# EAGLE design CarTracker (EAGLE 5.11)

## Sheet 1 of 7
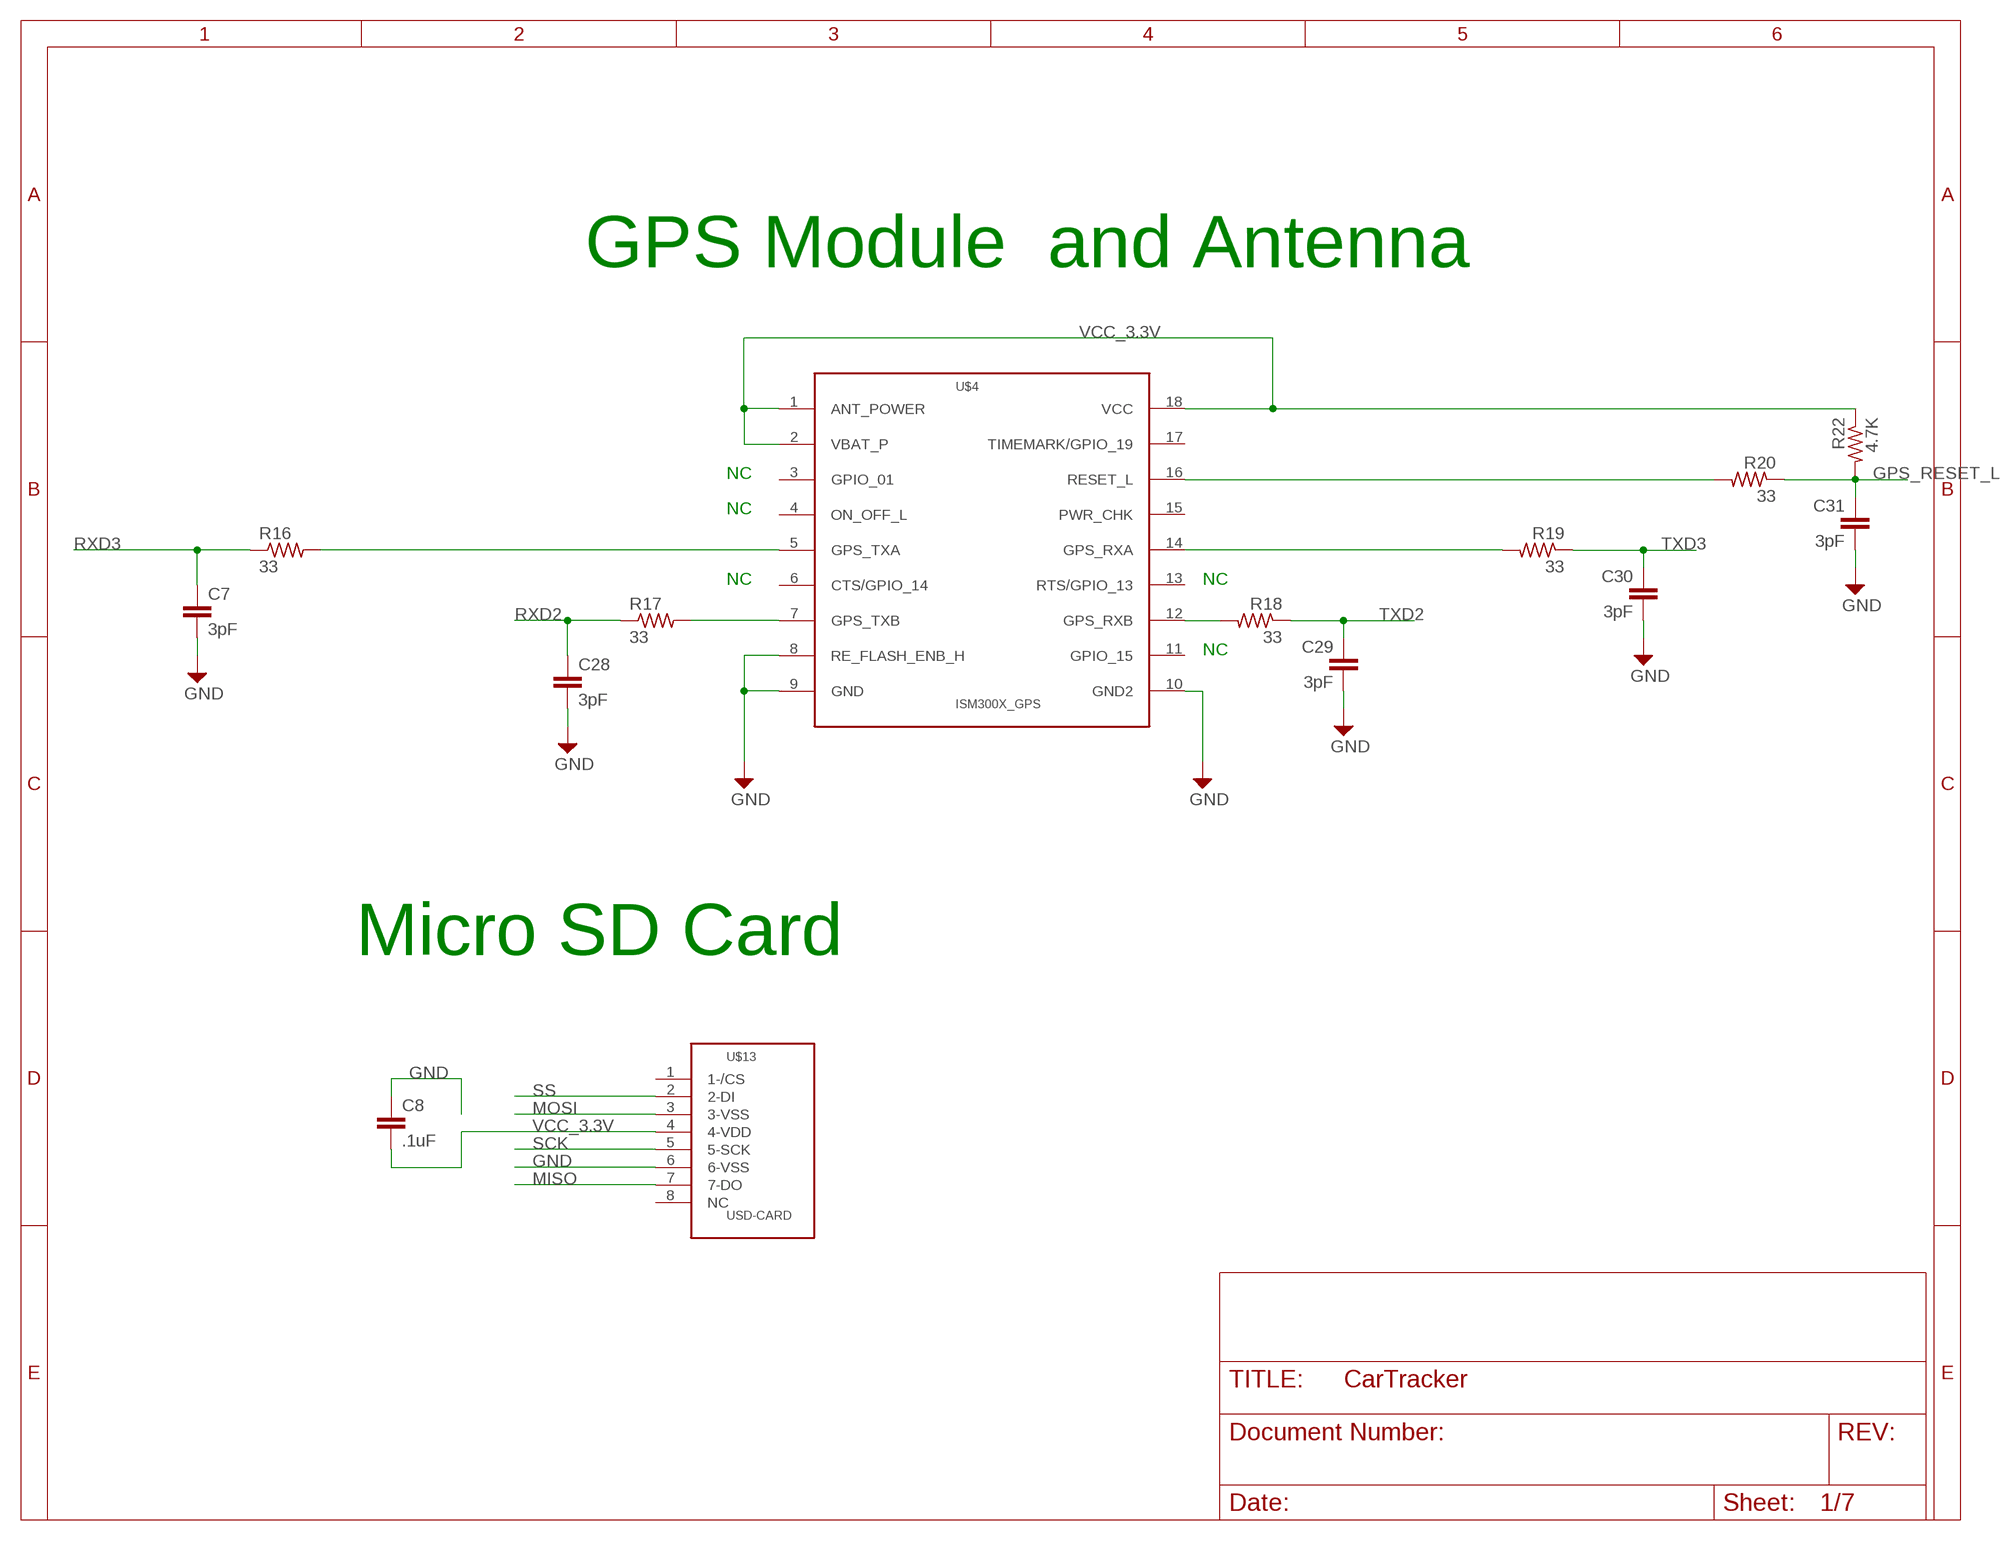
[diagram p0: schematic, sheet 1]

### Parts
C7  3pF  C-EUC0402  [C0402]
C8  .1uF  C-EUC0603  [C0603]
C28  3pF  C-EUC0402  [C0402]
C29  3pF  C-EUC0402  [C0402]
C30  3pF  C-EUC0402  [C0402]
C31  3pF  C-EUC0402  [C0402]
R16  33  R-US_R0402  [R0402]
R17  33  R-US_R0402  [R0402]
R18  33  R-US_R0603  [R0603]
R19  33  R-US_R0603  [R0603]
R20  33  R-US_R0603  [R0603]
R22  4.7K  R-US_R0603  [R0603]
U$4  ISM300X_GPS  [INVENTEKSYS_GPS]
U$13  USD-CARD  [502774-0891]

### Nets
GND [supply]: C7.2 C8.1 C28.2 C29.2 C30.2 C31.2 U$4.8(RE_FLASH_ENB_H) U$4.9(GND) U$4.10(GND2) U$13.6(6-VSS) ; also sheet 2,3,4,5,6,7
GPS_RESET_L: C31.1 R20.1 R22.2
MISO: U$13.7(7-DO) ; also sheet 5
MOSI: U$13.3(3-VSS) ; also sheet 5
N$5: R16.2 U$4.5(GPS_TXA)
N$6: R17.2 U$4.7(GPS_TXB)
N$8: R18.2 U$4.12(GPS_RXB)
N$9: R19.2 U$4.14(GPS_RXA)
N$10: R20.2 U$4.16(RESET_L)
RXD2: C28.1 R17.1 ; also sheet 5
RXD3: C7.1 R16.1 ; also sheet 5
SCK: U$13.5(5-SCK) ; also sheet 5
SS: U$13.2(2-DI) ; also sheet 5
TXD2: C29.1 R18.1 ; also sheet 5
TXD3: C30.1 R19.1 ; also sheet 5
VCC_3.3V: C8.2 R22.1 U$4.1(ANT_POWER) U$4.2(VBAT_P) U$4.18(VCC) U$13.4(4-VDD) ; also sheet 2,3,4,5,7
Unconnected: U$4.3(GPIO_01) U$4.4(ON_OFF_L) U$4.6(CTS/GPIO_14) U$4.11(GPIO_15) U$4.13(RTS/GPIO_13) U$4.15(PWR_CHK) U$4.17(TIMEMARK/GPIO_19) U$13.1(1-/CS) U$13.8(NC)

### Notes on the sheet
- GPS Module  and Antenna
- NC
- NC
- NC | NC
- NC
- Micro SD Card

## Sheet 2 of 7
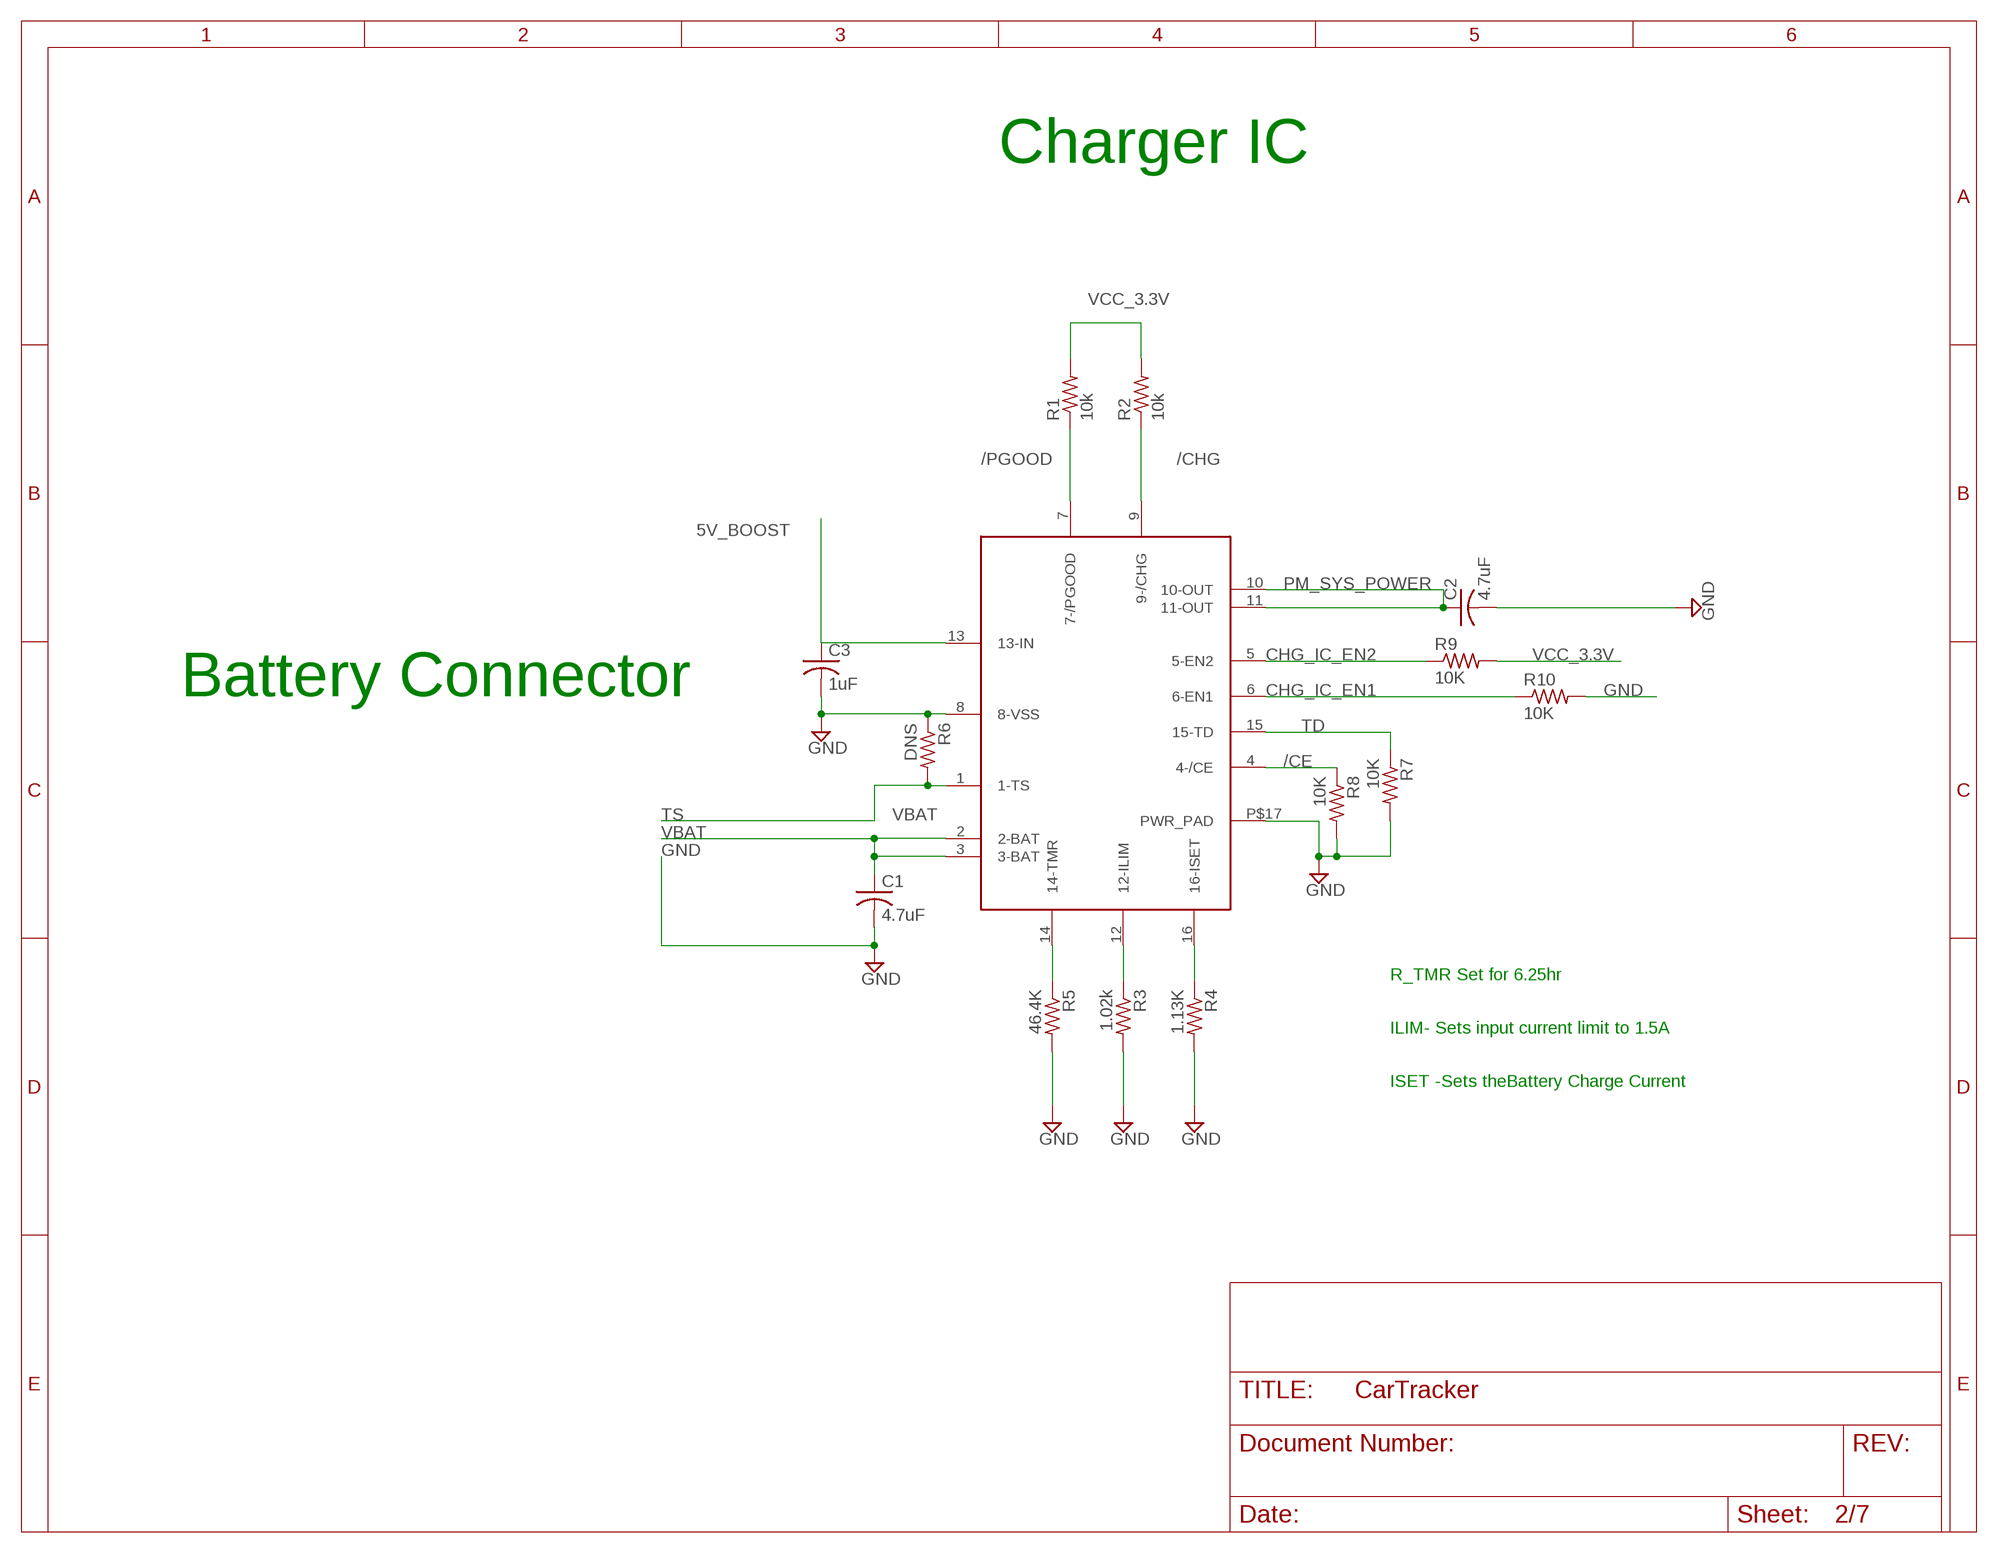
[diagram p1: schematic, sheet 2]

### Parts
C1  4.7uF  C-USC0805  [C0805]
C2  4.7uF  C-USC0805  [C0805]
C3  1uF  C-USC0805  [C0805]
R1  10k  R-US_R0603  [R0603]
R2  10k  R-US_R0603  [R0603]
R3  1.02k  R-US_R0603  [R0603]
R4  1.13K  R-US_R0603  [R0603]
R5  46.4K  R-US_R0603  [R0603]
R6  DNS  R-US_R0603  [R0603]
R7  10K  R-US_R0603  [R0603]
R8  10K  R-US_R0603  [R0603]
R9  10K  R-US_R0603  [R0603]
R10  10K  R-US_R0603  [R0603]
U$1  BQ24072  [S-PVQFN-N16]

### Nets
5V_BOOST: C3.1 U$1.13(13-IN) ; also sheet 3
/CE: R8.1 U$1.4(4-/CE)
/CHG: R2.1 U$1.9(9-/CHG) ; also sheet 5
/PGOOD: R1.1 U$1.7(7-/PGOOD) ; also sheet 5
CHG_IC_EN1: R10.1 U$1.6(6-EN1)
CHG_IC_EN2: R9.1 U$1.5(5-EN2)
GND [supply]: C1.2 C2.2 C3.2 R3.2 R4.2 R5.2 R6.1 R7.2 R8.2 R10.2 U$1.8(8-VSS) U$1.P$17(PWR_PAD) ; also sheet 1,3,4,5,6,7
N$1: R5.1 U$1.14(14-TMR)
N$2: R3.1 U$1.12(12-ILIM)
N$3: R4.1 U$1.16(16-ISET)
PM_SYS_POWER: C2.1 U$1.10(10-OUT) U$1.11(11-OUT) ; also sheet 3,4
TD: R7.1 U$1.15(15-TD)
TS: R6.2 U$1.1(1-TS)
VBAT: C1.1 U$1.2(2-BAT) U$1.3(3-BAT) ; also sheet 3
VCC_3.3V: R1.2 R2.2 R9.2 ; also sheet 1,3,4,5,7

### Notes on the sheet
- Charger IC
- Battery Connector
- R_TMR Set for 6.25hr
- ILIM- Sets input current limit to 1.5A
- ISET -Sets theBattery Charge Current

## Sheet 3 of 7
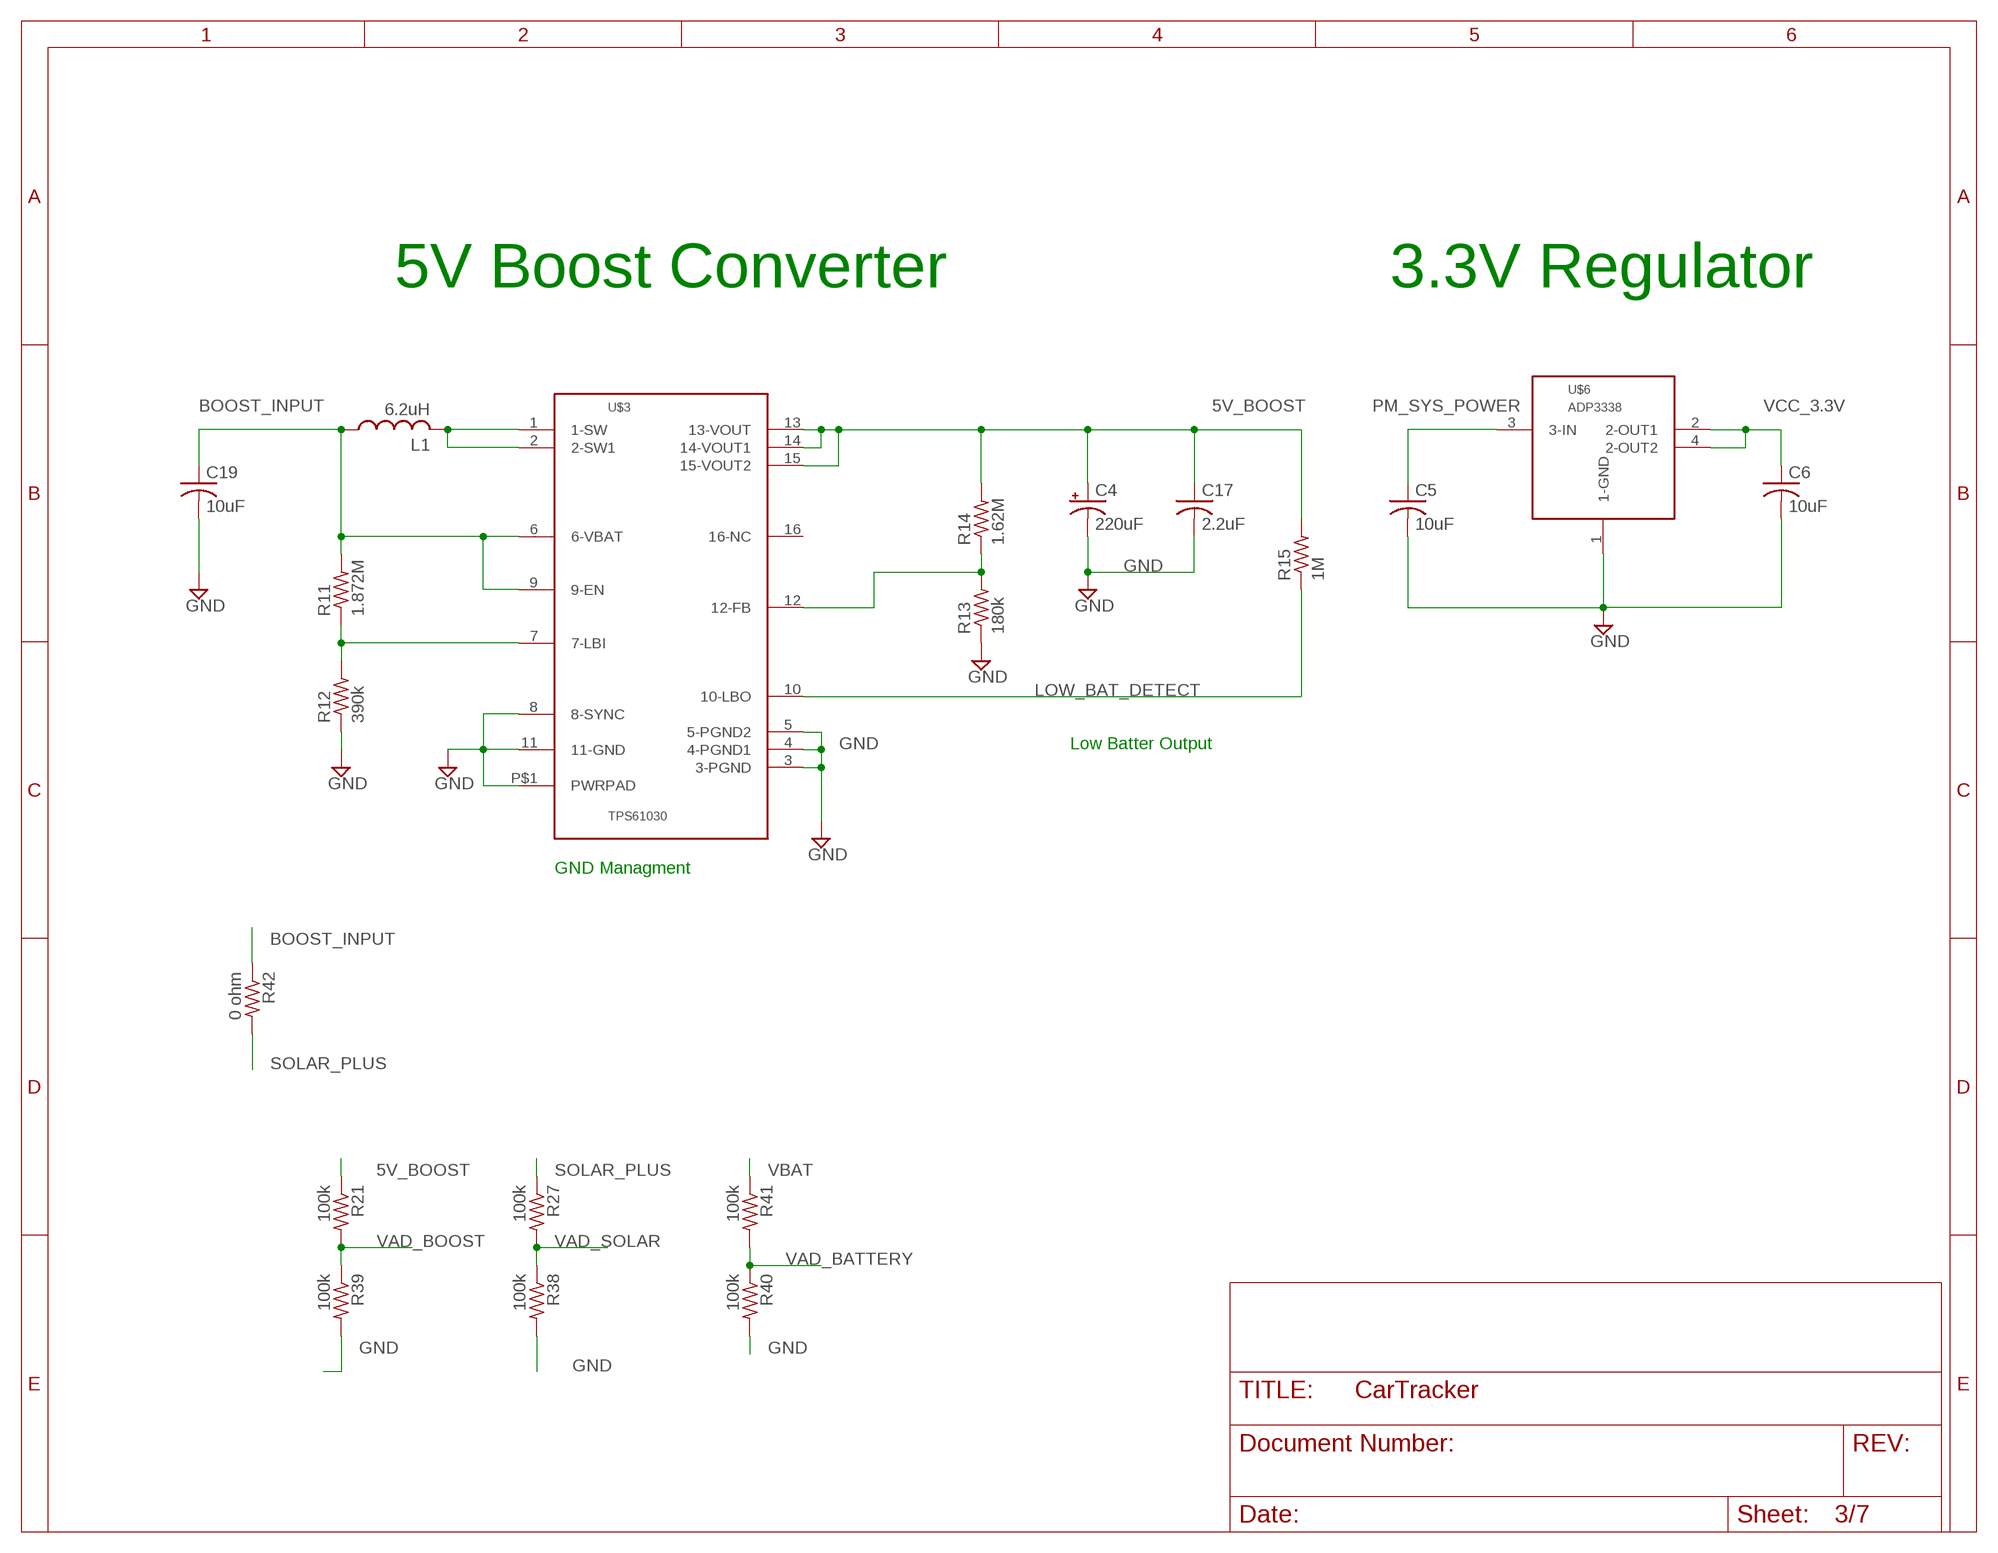
[diagram p2: schematic, sheet 3]

### Parts
C4  220uF  CPOL-USD/7343-31W  [D/7343-31W]
C5  10uF  C-USC1206  [C1206]
C6  10uF  C-USC1206  [C1206]
C17  2.2uF  C-USC0805  [C0805]
C19  10uF  C-USC1206  [C1206]
L1  6.2uH  L_US  [INDUCTOR_7447798620]
R11  1.872M  R-US_R0603  [R0603]
R12  390k  R-US_R0603  [R0603]
R13  180k  R-US_R0603  [R0603]
R14  1.62M  R-US_R0603  [R0603]
R15  1M  R-US_R0603  [R0603]
R21  100k  R-US_R0603  [R0603]
R27  100k  R-US_R0603  [R0603]
R38  100k  R-US_R0603  [R0603]
R39  100k  R-US_R0603  [R0603]
R40  100k  R-US_R0603  [R0603]
R41  100k  R-US_R0603  [R0603]
R42  0 ohm  R-US_R0603  [R0603]
U$3  TPS61030  [TSSOP16_TI]
U$6  ADP3338  [SOT223]

### Nets
5V_BOOST: C4.+ C17.1 R14.2 R15.2 R21.1 U$3.13(13-VOUT) U$3.14(14-VOUT1) U$3.15(15-VOUT2) ; also sheet 2
BOOST_INPUT: C19.1 L1.P$1 R11.2 R42.1 U$3.6(6-VBAT) U$3.9(9-EN)
GND [supply]: C4.- C5.2 C6.2 C17.2 C19.2 R12.1 R13.1 R38.2 R39.2 R40.2 U$3.3(3-PGND) U$3.4(4-PGND1) U$3.5(5-PGND2) U$3.8(8-SYNC) U$3.11(11-GND) U$3.P$1(PWRPAD) U$6.1(1-GND) ; also sheet 1,2,4,5,6,7
LOW_BAT_DETECT: R15.1 U$3.10(10-LBO) ; also sheet 5
N$14: L1.P$2 U$3.1(1-SW) U$3.2(2-SW1)
N$20: R11.1 R12.2 U$3.7(7-LBI)
N$24: R13.2 R14.1 U$3.12(12-FB)
PM_SYS_POWER: C5.1 U$6.3(3-IN) ; also sheet 2,4
SOLAR_PLUS: R27.1 R42.2 ; also sheet 6
VAD_BATTERY: R40.1 R41.2 ; also sheet 5
VAD_BOOST: R21.2 R39.1 ; also sheet 5
VAD_SOLAR: R27.2 R38.1 ; also sheet 5
VBAT: R41.1 ; also sheet 2
VCC_3.3V: C6.1 U$6.2(2-OUT1) U$6.4(2-OUT2) ; also sheet 1,2,4,5,7
Unconnected: U$3.16(16-NC)

### Notes on the sheet
- 5V Boost Converter | 3.3V Regulator
- Low Batter Output
- GND Managment

## Sheet 4 of 7
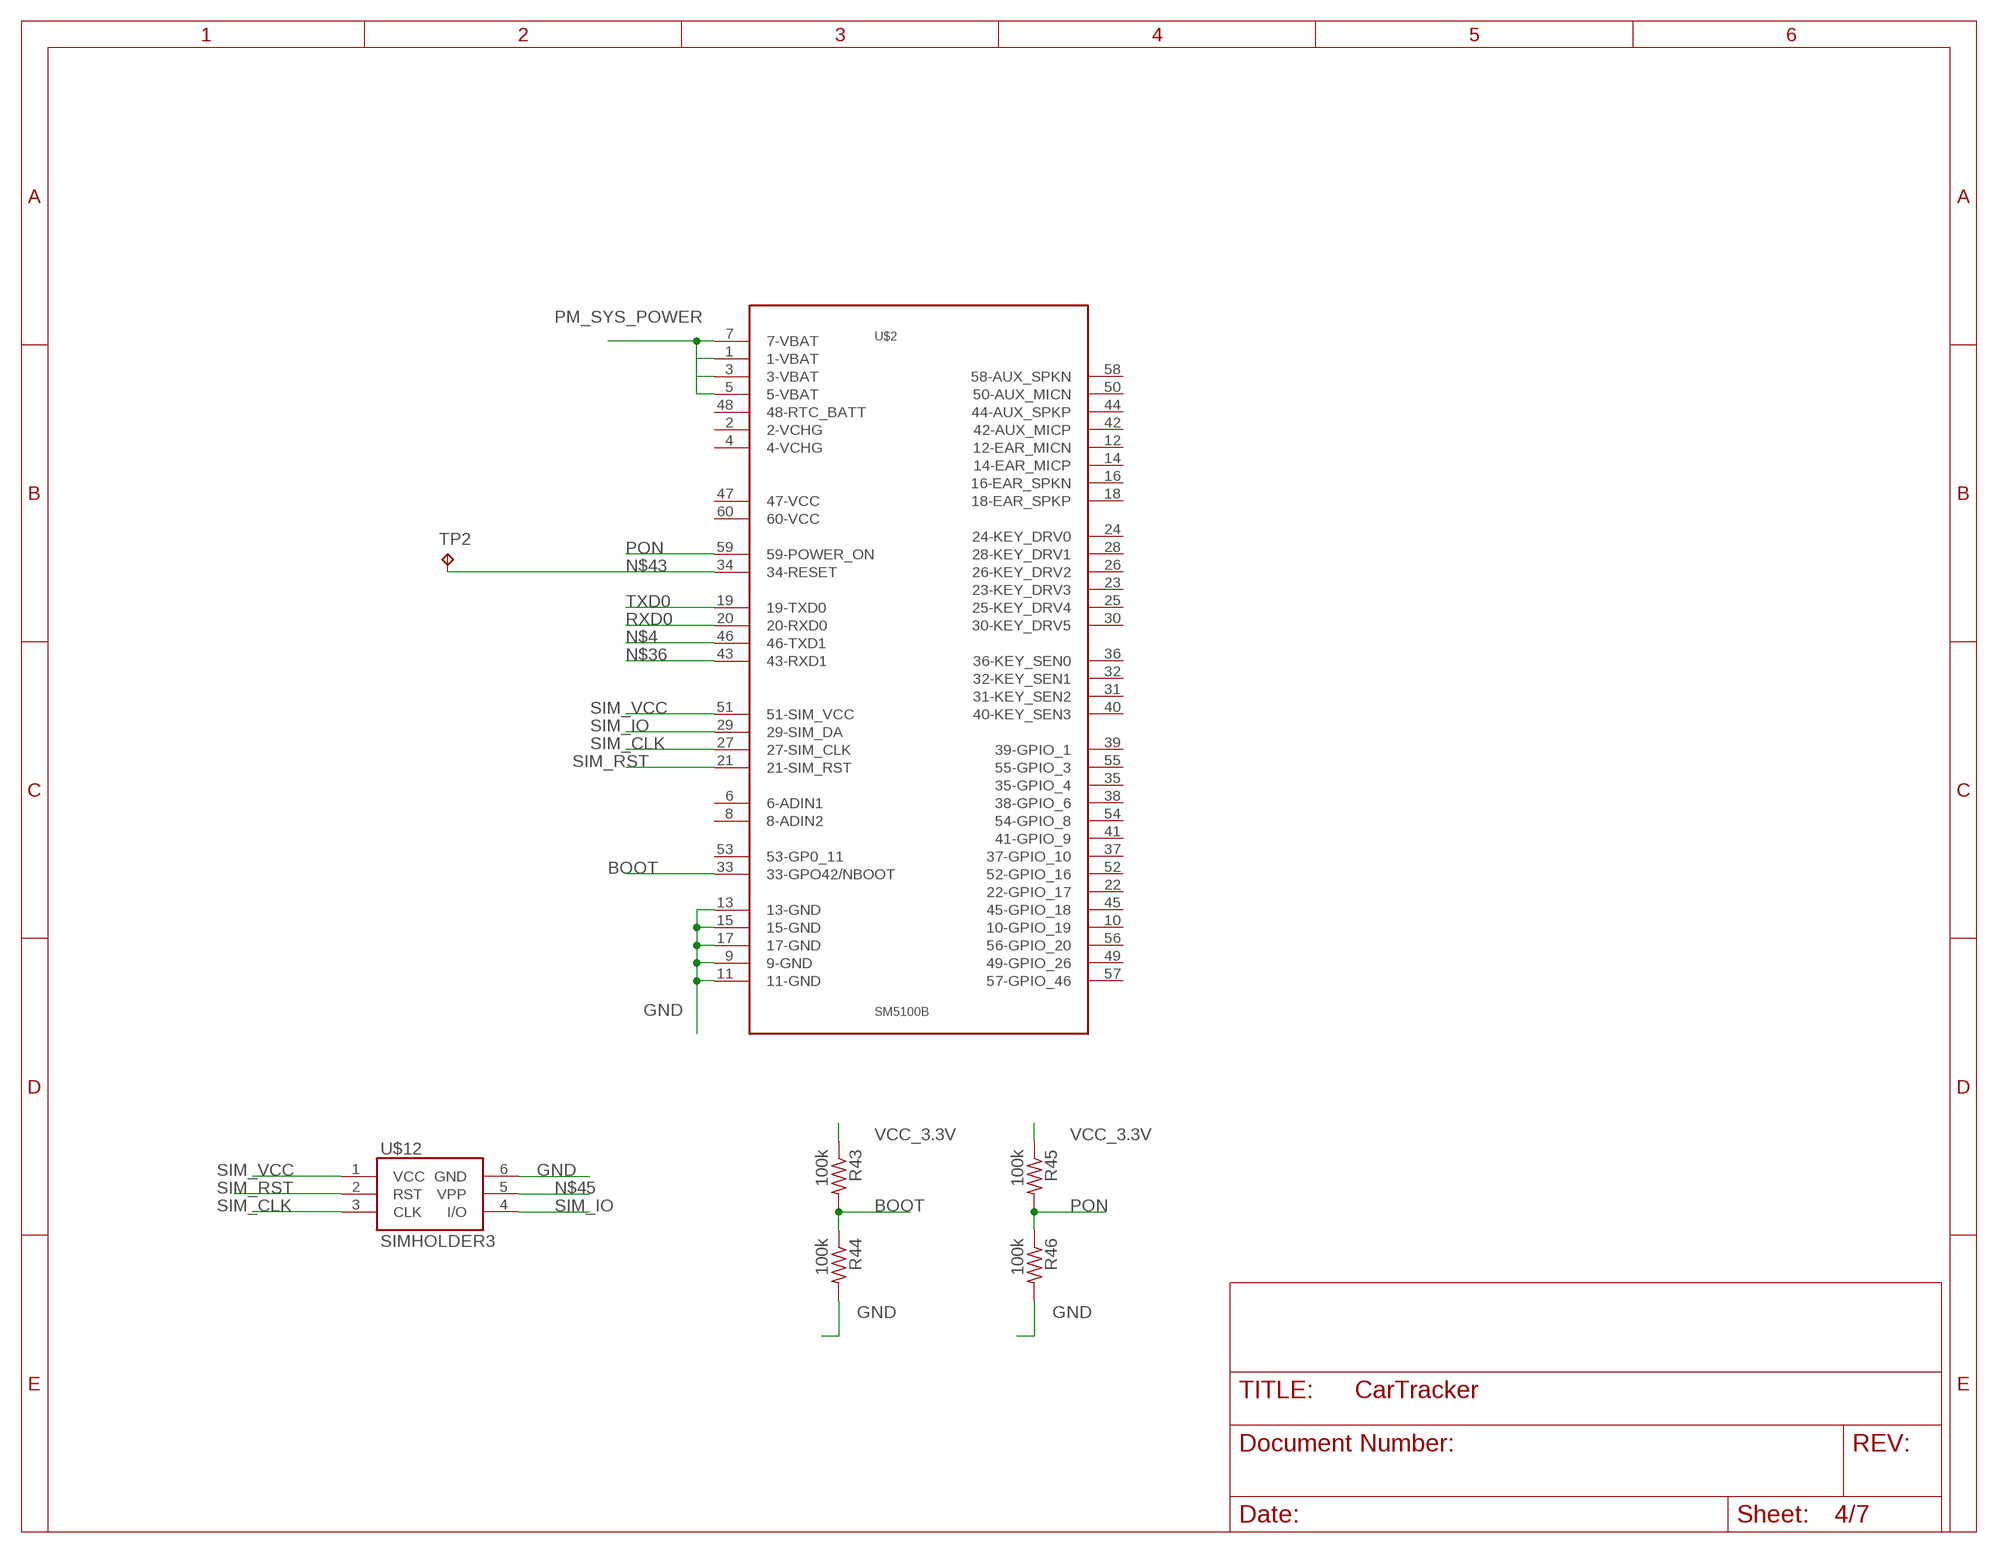
[diagram p3: schematic, sheet 4]

### Parts
R43  100k  R-US_R0603  [R0603]
R44  100k  R-US_R0603  [R0603]
R45  100k  R-US_R0603  [R0603]
R46  100k  R-US_R0603  [R0603]
TP2  TPTP15R  [TP15R]
U$2  SM5100B  [SM5100B]
U$12  SIMHOLDER3  [SIMHOLDER3]

### Nets
BOOT: R43.2 R44.1 U$2.33(33-GPO42/NBOOT)
GND [supply]: R44.2 R46.2 U$2.9(9-GND) U$2.11(11-GND) U$2.13(13-GND) U$2.15(15-GND) U$2.17(17-GND) U$12.6(GND) ; also sheet 1,2,3,5,6,7
N$4: U$2.46(46-TXD1)
N$36: U$2.43(43-RXD1)
N$43: TP2.TP U$2.34(34-RESET)
N$45: U$12.5(VPP)
PM_SYS_POWER: U$2.1(1-VBAT) U$2.3(3-VBAT) U$2.5(5-VBAT) U$2.7(7-VBAT) ; also sheet 2,3
PON: R45.2 R46.1 U$2.59(59-POWER_ON)
RXD0: U$2.20(20-RXD0) ; also sheet 5
SIM_CLK: U$2.27(27-SIM_CLK) U$12.3(CLK)
SIM_IO: U$2.29(29-SIM_DA) U$12.4(I/O)
SIM_RST: U$2.21(21-SIM_RST) U$12.2(RST)
SIM_VCC: U$2.51(51-SIM_VCC) U$12.1(VCC)
TXD0: U$2.19(19-TXD0) ; also sheet 5
VCC_3.3V: R43.1 R45.1 ; also sheet 1,2,3,5,7
Unconnected: U$2.2(2-VCHG) U$2.4(4-VCHG) U$2.6(6-ADIN1) U$2.8(8-ADIN2) U$2.10(10-GPIO_19) U$2.12(12-EAR_MICN) U$2.14(14-EAR_MICP) U$2.16(16-EAR_SPKN) U$2.18(18-EAR_SPKP) U$2.22(22-GPIO_17) U$2.23(23-KEY_DRV3) U$2.24(24-KEY_DRV0) U$2.25(25-KEY_DRV4) U$2.26(26-KEY_DRV2) U$2.28(28-KEY_DRV1) U$2.30(30-KEY_DRV5) U$2.31(31-KEY_SEN2) U$2.32(32-KEY_SEN1) U$2.35(35-GPIO_4) U$2.36(36-KEY_SEN0) U$2.37(37-GPIO_10) U$2.38(38-GPIO_6) U$2.39(39-GPIO_1) U$2.40(40-KEY_SEN3) U$2.41(41-GPIO_9) U$2.42(42-AUX_MICP) U$2.44(44-AUX_SPKP) U$2.45(45-GPIO_18) U$2.47(47-VCC) U$2.48(48-RTC_BATT) U$2.49(49-GPIO_26) U$2.50(50-AUX_MICN) U$2.52(52-GPIO_16) U$2.53(53-GP0_11) U$2.54(54-GPIO_8) U$2.55(55-GPIO_3) U$2.56(56-GPIO_20) U$2.57(57-GPIO_46) U$2.58(58-AUX_SPKN) U$2.60(60-VCC)

## Sheet 5 of 7
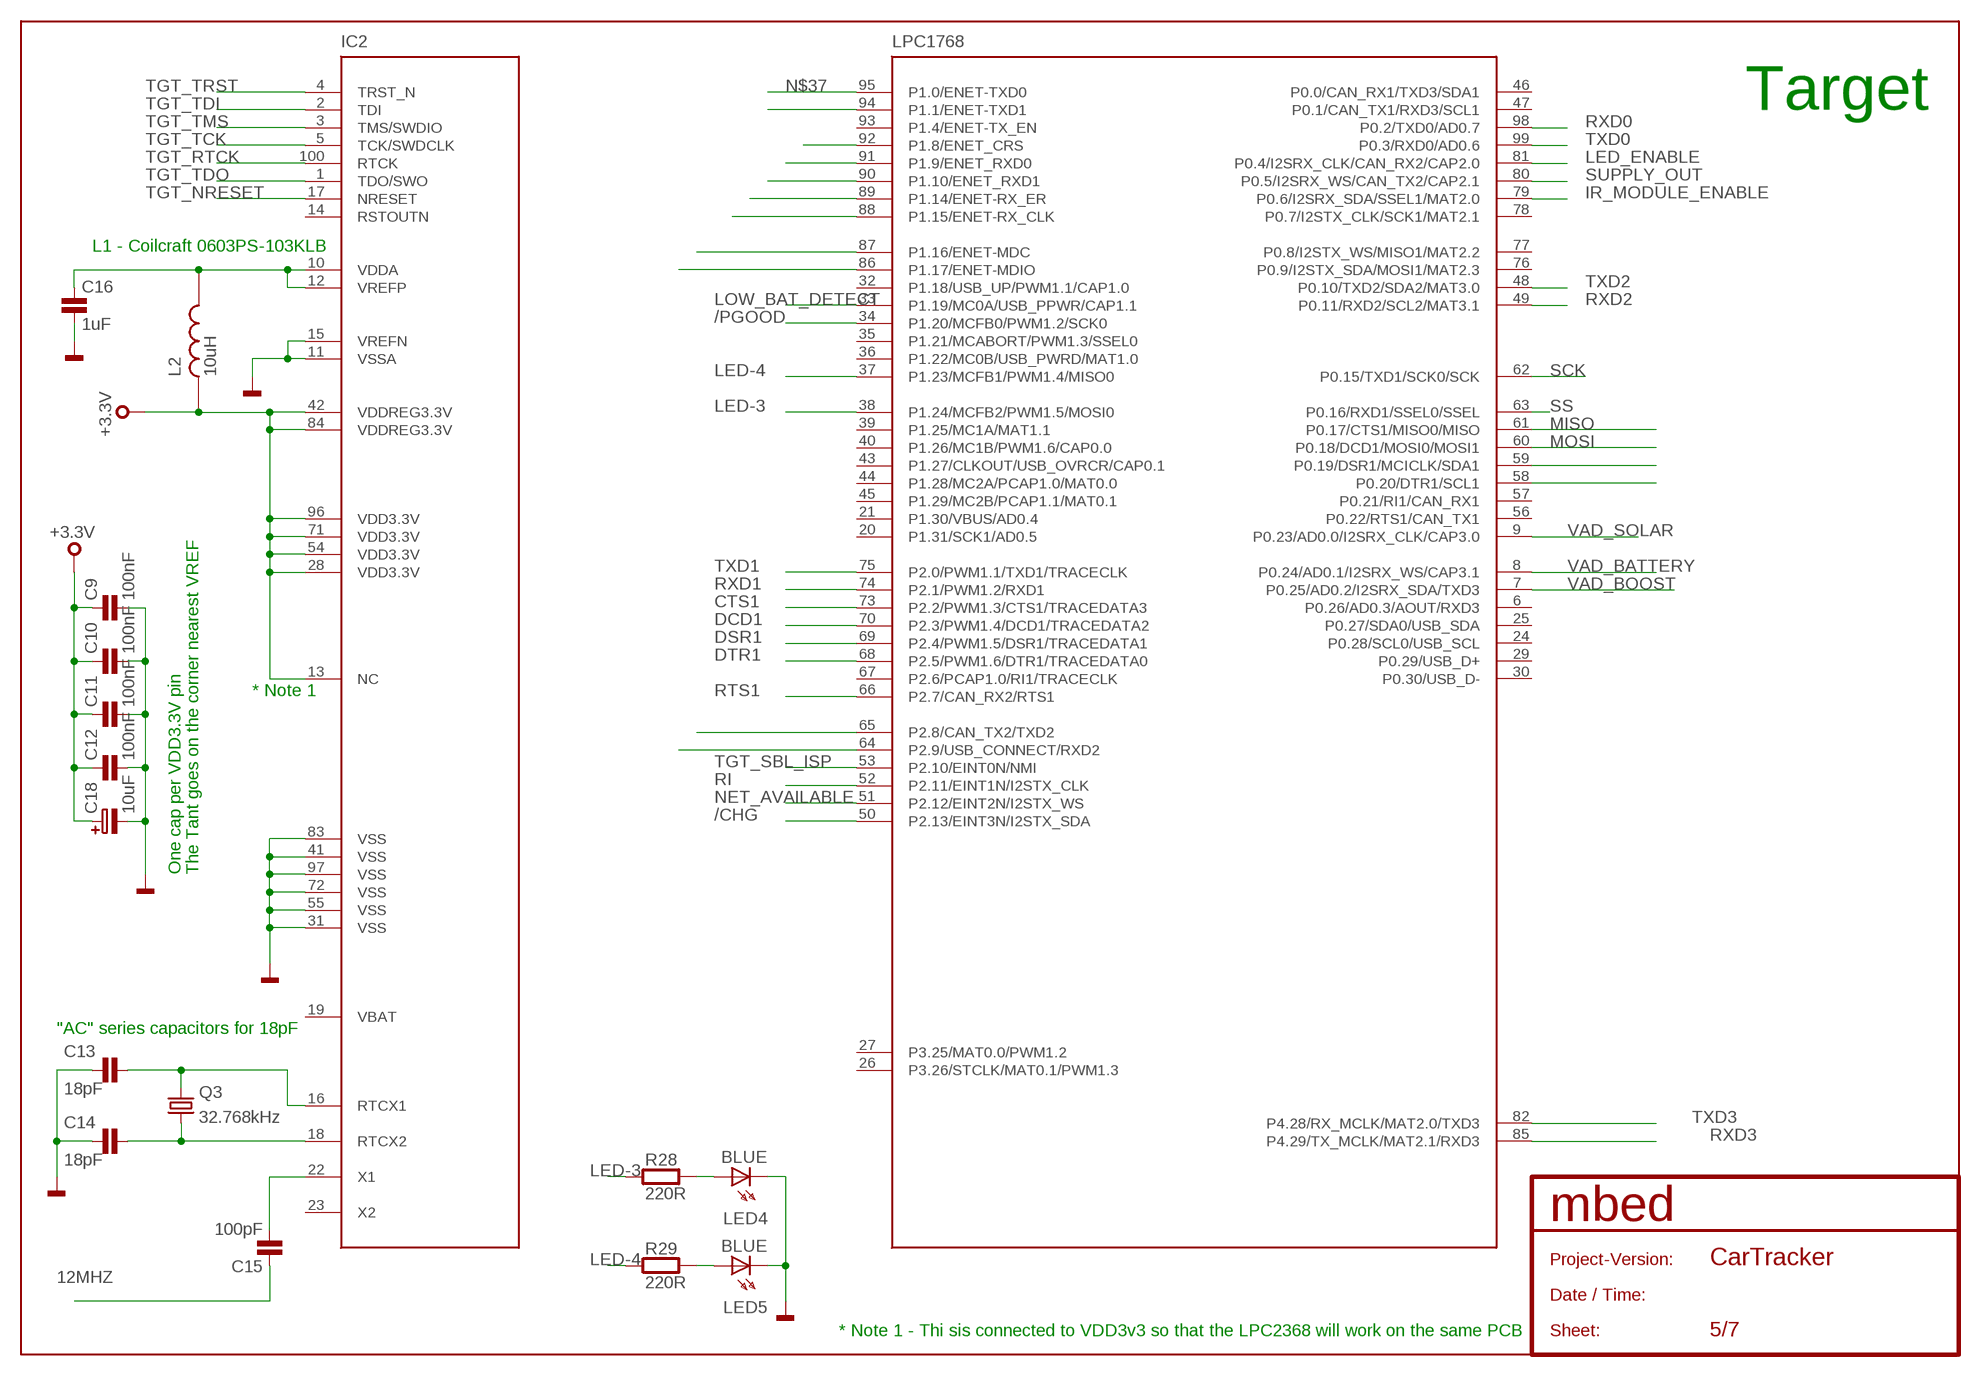
[diagram p4: schematic, sheet 5]

### Parts
C9  100nF  C0603  [0603]
C10  100nF  C0603  [0603]
C11  100nF  C0603  [0603]
C12  100nF  C0603  [0603]
C13  18pF  C0603  [0603]
C14  18pF  C0603  [0603]
C15  100pF  C0603  [0603]
C16  1uF  C0805  [0805]
C18  10uF  C-POLARISEDSMT_TANTALUM  [C106B]
IC2  LPC1768  [LQFP100]
L2  10uH  L_L  [L0603]
LED4  BLUE  LED_0805  [LED_0805]
LED5  BLUE  LED_0805  [LED_0805]
Q3  32.768kHz  CRYSTALFC135  [FC135]
R28  220R  R0603  [0603]
R29  220R  R0603  [0603]

### Nets
12MHZ: C15.1 ; also sheet 7
/CHG: IC2.50(P2.13/EINT3N/I2STX_SDA) ; also sheet 2
/PGOOD: IC2.34(P1.20/MCFB0/PWM1.2/SCK0) ; also sheet 2
CTS1: IC2.73(P2.2/PWM1.3/CTS1/TRACEDATA3)
DCD1: IC2.70(P2.3/PWM1.4/DCD1/TRACEDATA2)
DSR1: IC2.69(P2.4/PWM1.5/DSR1/TRACEDATA1)
DTR1: IC2.68(P2.5/PWM1.6/DTR1/TRACEDATA0)
GND [supply]: C9.2 C10.2 C11.2 C12.2 C13.1 C14.1 C16.2 C18.2 IC2.11(VSSA) IC2.15(VREFN) IC2.31(VSS) IC2.41(VSS) IC2.55(VSS) IC2.72(VSS) IC2.83(VSS) IC2.97(VSS) LED4.K LED5.K ; also sheet 1,2,3,4,6,7
IC6_RTC1: C13.2 IC2.16(RTCX1) Q3.X2
IC6_RTC2: C14.2 IC2.18(RTCX2) Q3.X1
IC6_XTAL1: C15.2 IC2.22(X1)
IR_MODULE_ENABLE: IC2.79(P0.6/I2SRX_SDA/SSEL1/MAT2.0)
LED-3: IC2.38(P1.24/MCFB2/PWM1.5/MOSI0) R28.1
LED-4: IC2.37(P1.23/MCFB1/PWM1.4/MISO0) R29.1
LED_ENABLE: IC2.81(P0.4/I2SRX_CLK/CAN_RX2/CAP2.0)
LOW_BAT_DETECT: IC2.33(P1.19/MC0A/USB_PPWR/CAP1.1) ; also sheet 3
MISO: IC2.61(P0.17/CTS1/MISO0/MISO) ; also sheet 1
MOSI: IC2.60(P0.18/DCD1/MOSI0/MOSI1) ; also sheet 1
N$7: C16.1 IC2.10(VDDA) IC2.12(VREFP) L2.P$2
N$13: IC2.86(P1.17/ENET-MDIO)
N$15: IC2.87(P1.16/ENET-MDC)
N$16: IC2.88(P1.15/ENET-RX_CLK)
N$17: LED5.A R29.2
N$18: LED4.A R28.2
N$19: IC2.89(P1.14/ENET-RX_ER)
N$21: IC2.90(P1.10/ENET_RXD1)
N$22: IC2.91(P1.9/ENET_RXD0)
N$23: IC2.92(P1.8/ENET_CRS)
N$25: IC2.65(P2.8/CAN_TX2/TXD2)
N$26: IC2.64(P2.9/USB_CONNECT/RXD2)
N$27: IC2.58(P0.20/DTR1/SCL1)
N$28: IC2.59(P0.19/DSR1/MCICLK/SDA1)
N$37: IC2.95(P1.0/ENET-TXD0)
N$38: IC2.94(P1.1/ENET-TXD1)
NET_AVAILABLE: IC2.51(P2.12/EINT2N/I2STX_WS)
RI: IC2.52(P2.11/EINT1N/I2STX_CLK)
RTS1: IC2.66(P2.7/CAN_RX2/RTS1)
RXD0: IC2.98(P0.2/TXD0/AD0.7) ; also sheet 4
RXD1: IC2.74(P2.1/PWM1.2/RXD1)
RXD2: IC2.49(P0.11/RXD2/SCL2/MAT3.1) ; also sheet 1
RXD3: IC2.85(P4.29/TX_MCLK/MAT2.1/RXD3) ; also sheet 1
SCK: IC2.62(P0.15/TXD1/SCK0/SCK) ; also sheet 1
SS: IC2.63(P0.16/RXD1/SSEL0/SSEL) ; also sheet 1
SUPPLY_OUT: IC2.80(P0.5/I2SRX_WS/CAN_TX2/CAP2.1)
TGT_NRESET: IC2.17(NRESET) ; also sheet 7
TGT_RTCK: IC2.100(RTCK) ; also sheet 7
TGT_SBL_ISP: IC2.53(P2.10/EINT0N/NMI) ; also sheet 7
TGT_TCK: IC2.5(TCK/SWDCLK) ; also sheet 7
TGT_TDI: IC2.2(TDI) ; also sheet 7
TGT_TDO: IC2.1(TDO/SWO) ; also sheet 7
TGT_TMS: IC2.3(TMS/SWDIO) ; also sheet 7
TGT_TRST: IC2.4(TRST_N) ; also sheet 7
TXD0: IC2.99(P0.3/RXD0/AD0.6) ; also sheet 4
TXD1: IC2.75(P2.0/PWM1.1/TXD1/TRACECLK)
TXD2: IC2.48(P0.10/TXD2/SDA2/MAT3.0) ; also sheet 1
TXD3: IC2.82(P4.28/RX_MCLK/MAT2.0/TXD3) ; also sheet 1
VAD_BATTERY: IC2.8(P0.24/AD0.1/I2SRX_WS/CAP3.1) ; also sheet 3
VAD_BOOST: IC2.7(P0.25/AD0.2/I2SRX_SDA/TXD3) ; also sheet 3
VAD_SOLAR: IC2.9(P0.23/AD0.0/I2SRX_CLK/CAP3.0) ; also sheet 3
VCC_3.3V: C9.1 C10.1 C11.1 C12.1 C18.1 IC2.13(NC) IC2.28(VDD3.3V) IC2.42(VDDREG3.3V) IC2.54(VDD3.3V) IC2.71(VDD3.3V) IC2.84(VDDREG3.3V) IC2.96(VDD3.3V) L2.P$1 ; supply symbol labelled +3.3V ; also sheet 1,2,3,4,7
Unconnected: IC2.6(P0.26/AD0.3/AOUT/RXD3) IC2.14(RSTOUTN) IC2.19(VBAT) IC2.20(P1.31/SCK1/AD0.5) IC2.21(P1.30/VBUS/AD0.4) IC2.23(X2) IC2.24(P0.28/SCL0/USB_SCL) IC2.25(P0.27/SDA0/USB_SDA) IC2.26(P3.26/STCLK/MAT0.1/PWM1.3) IC2.27(P3.25/MAT0.0/PWM1.2) IC2.29(P0.29/USB_D+) IC2.30(P0.30/USB_D-) IC2.32(P1.18/USB_UP/PWM1.1/CAP1.0) IC2.35(P1.21/MCABORT/PWM1.3/SSEL0) IC2.36(P1.22/MC0B/USB_PWRD/MAT1.0) IC2.39(P1.25/MC1A/MAT1.1) IC2.40(P1.26/MC1B/PWM1.6/CAP0.0) IC2.43(P1.27/CLKOUT/USB_OVRCR/CAP0.1) IC2.44(P1.28/MC2A/PCAP1.0/MAT0.0) IC2.45(P1.29/MC2B/PCAP1.1/MAT0.1) IC2.46(P0.0/CAN_RX1/TXD3/SDA1) IC2.47(P0.1/CAN_TX1/RXD3/SCL1) IC2.56(P0.22/RTS1/CAN_TX1) IC2.57(P0.21/RI1/CAN_RX1) IC2.67(P2.6/PCAP1.0/RI1/TRACECLK) IC2.76(P0.9/I2STX_SDA/MOSI1/MAT2.3) IC2.77(P0.8/I2STX_WS/MISO1/MAT2.2) IC2.78(P0.7/I2STX_CLK/SCK1/MAT2.1) IC2.93(P1.4/ENET-TX_EN)

### Notes on the sheet
- Target
- L1 - Coilcraft 0603PS-103KLB
- * Note 1
- One cap per VDD3.3V pin | The Tant goes on the corner nearest VREF
- "AC" series capacitors for 18pF
- * Note 1 - Thi sis connected to VDD3v3 so that the LPC2368 will work on the same PCB

## Sheet 6 of 7
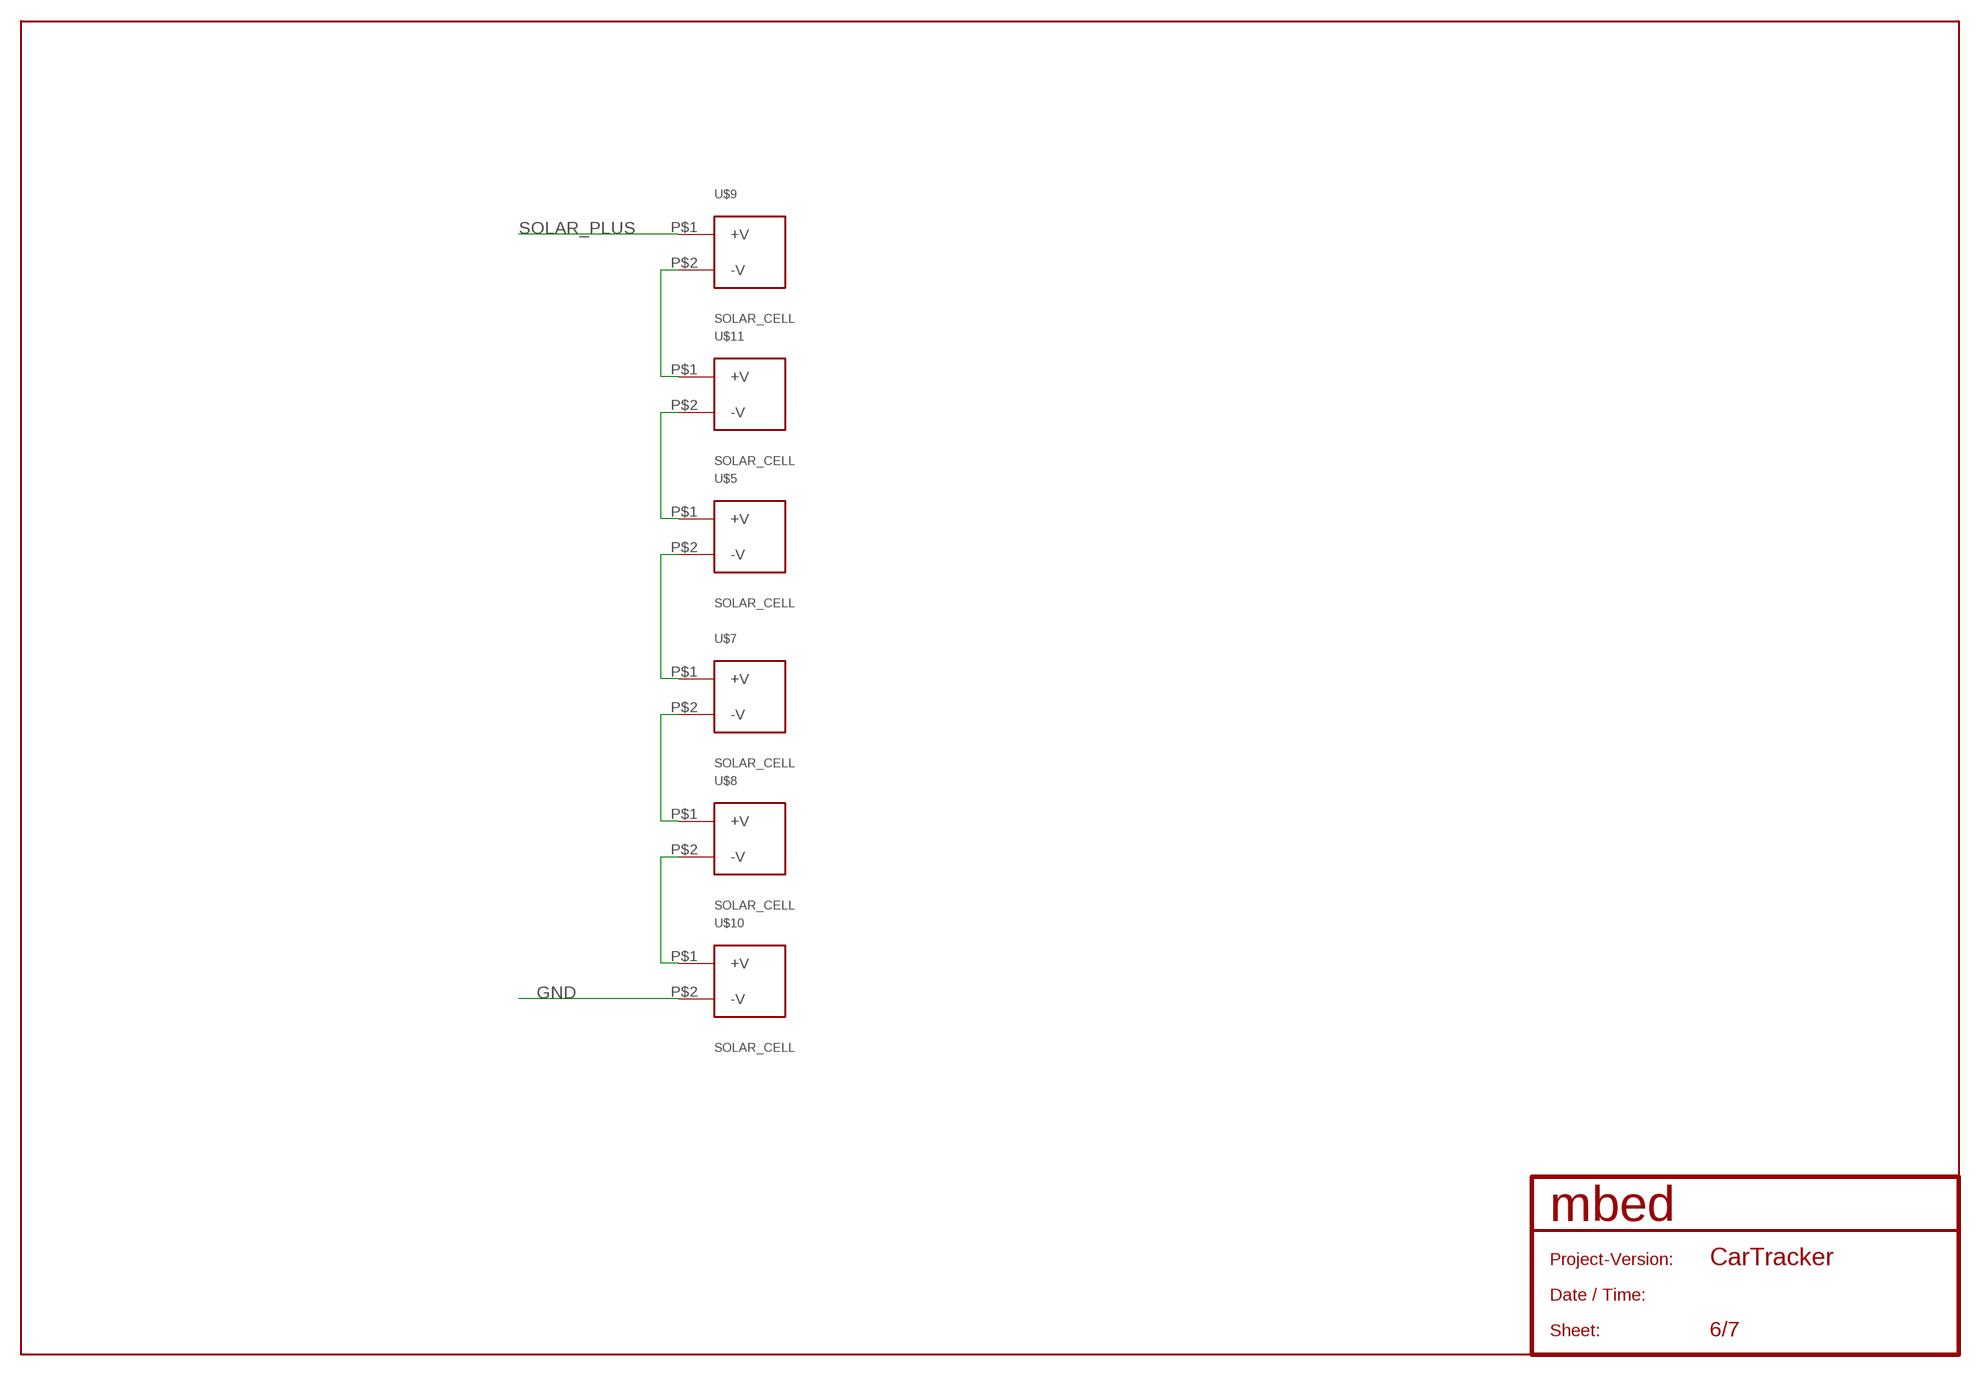
[diagram p5: schematic, sheet 6]

### Parts
U$5  SOLAR_CELL  [SOLAR_CELL]
U$7  SOLAR_CELL  [SOLAR_CELL]
U$8  SOLAR_CELL  [SOLAR_CELL]
U$9  SOLAR_CELL  [SOLAR_CELL]
U$10  SOLAR_CELL  [SOLAR_CELL]
U$11  SOLAR_CELL  [SOLAR_CELL]

### Nets
GND [supply]: U$10.P$2(-V) ; also sheet 1,2,3,4,5,7
N$11: U$8.P$2(-V) U$10.P$1(+V)
N$12: U$7.P$2(-V) U$8.P$1(+V)
N$33: U$5.P$2(-V) U$7.P$1(+V)
N$34: U$5.P$1(+V) U$11.P$2(-V)
N$35: U$9.P$2(-V) U$11.P$1(+V)
SOLAR_PLUS: U$9.P$1(+V) ; also sheet 3

## Sheet 7 of 7
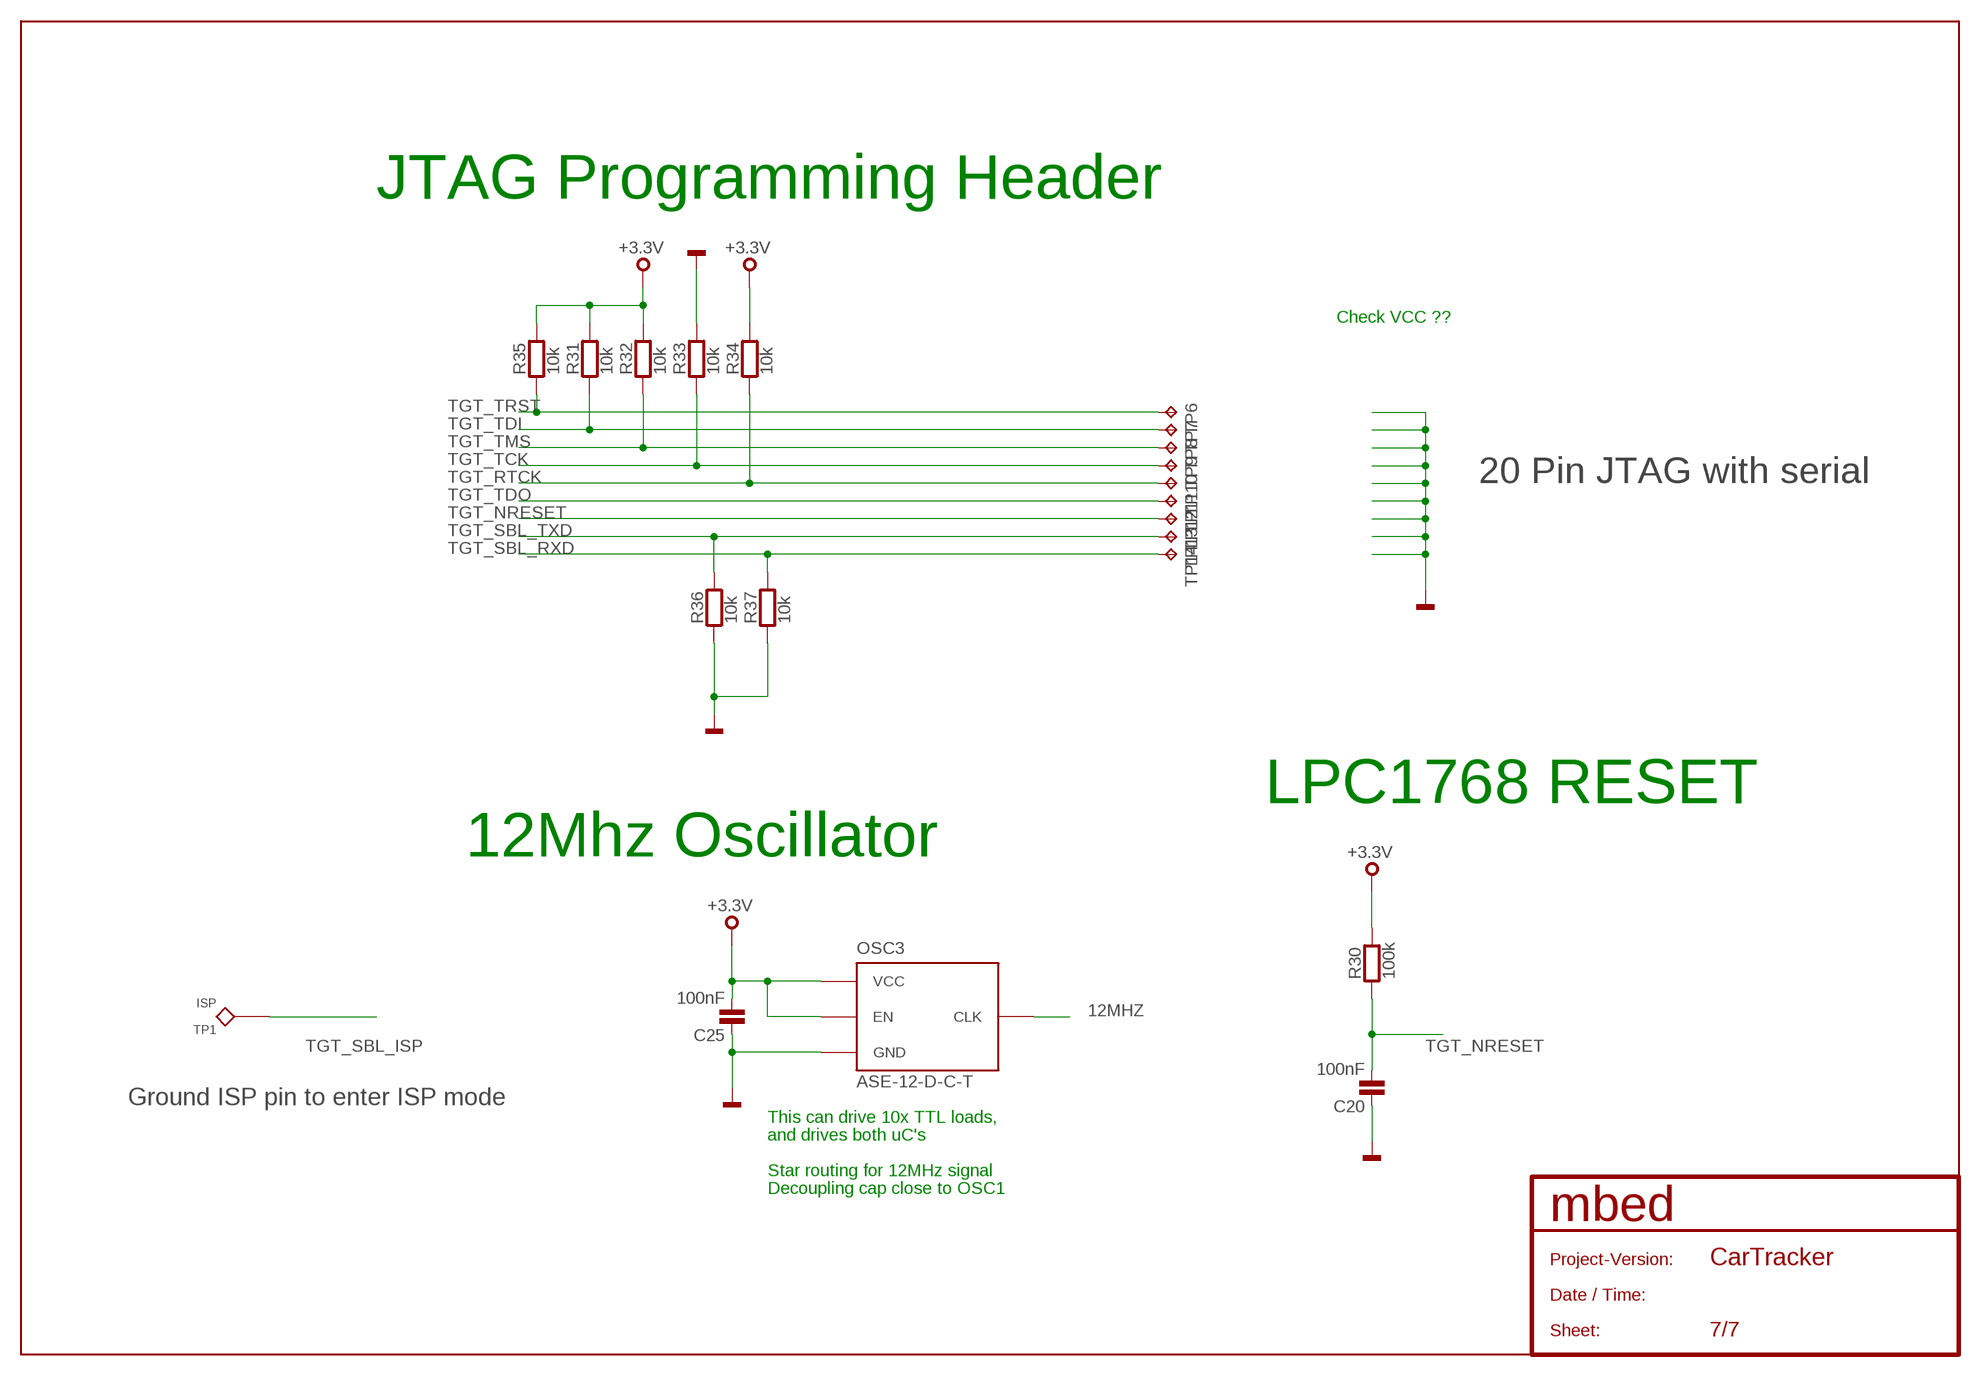
[diagram p6: schematic, sheet 7]

### Parts
C20  100nF  C0603  [0603]
C25  100nF  C0603  [0603]
OSC3  ASE-12-D-C-T  OSCILLATOR_2.5X3.2  [OSC3.2X.2.5]
R30  100k  R0603  [0603]
R31  10k  R0603  [0603]
R32  10k  R0603  [0603]
R33  10k  R0603  [0603]
R34  10k  R0603  [0603]
R35  10k  R0603  [0603]
R36  10k  R0603  [0603]
R37  10k  R0603  [0603]
TP1  ISP  TP  [P1-13]
TP6  TPTP15R  [TP15R]
TP7  TPTP15R  [TP15R]
TP8  TPTP15R  [TP15R]
TP9  TPTP15R  [TP15R]
TP10  TPTP15R  [TP15R]
TP11  TPTP15R  [TP15R]
TP12  TPTP15R  [TP15R]
TP13  TPTP15R  [TP15R]
TP14  TPTP15R  [TP15R]

### Nets
12MHZ: OSC3.P$3(CLK) ; also sheet 5
GND [supply]: C20.1 C25.1 OSC3.P$2(GND) R33.2 R36.1 R37.1 ; also sheet 1,2,3,4,5,6
TGT_NRESET: C20.2 R30.1 TP12.TP ; also sheet 5
TGT_RTCK: R34.1 TP10.TP ; also sheet 5
TGT_SBL_ISP: TP1.1 ; also sheet 5
TGT_SBL_RXD: R37.2 TP14.TP
TGT_SBL_TXD: R36.2 TP13.TP
TGT_TCK: R33.1 TP9.TP ; also sheet 5
TGT_TDI: R31.1 TP7.TP ; also sheet 5
TGT_TDO: TP11.TP ; also sheet 5
TGT_TMS: R32.1 TP8.TP ; also sheet 5
TGT_TRST: R35.1 TP6.TP ; also sheet 5
VCC_3.3V: C25.2 OSC3.P$1(EN) OSC3.P$4(VCC) R30.2 R31.2 R32.2 R34.2 R35.2 ; supply symbol labelled +3.3V ; also sheet 1,2,3,4,5

### Notes on the sheet
- JTAG Programming Header
- Check VCC ??
- 20 Pin JTAG with serial
- LPC1768 RESET
- 12Mhz Oscillator
- Ground ISP pin to enter ISP mode
- This can drive 10x TTL loads,
- and drives both uC's
- Star routing for 12MHz signal
- Decoupling cap close to OSC1

## Library data of the parts
C1-C3 C5 C6 C17 C19 = rcl:C-US: CAPACITOR, American symbol
C4 = rcl:CPOL-US: POLARIZED CAPACITOR, American symbol
C7 C8 C28-C31 = rcl:C-EU: CAPACITOR, European symbol
C9-C16 C20 C25 = mbed:C
C18 = mbed:C-POLARISED
IC2 = mbed:LPC1768
L1 = m-pad-2.1:L_US: Inductors in various packages from: - Sumida - Panasonic - Coilcraft
L2 = mbed:L
LED4 LED5 = mbed:LED
OSC3 = mbed:OSCILLATOR
Q3 = LPC1768RefDesign:CRYSTAL: CRYSTAL
R1-R22 R27 R38-R46 = rcl:R-US_: RESISTOR, American symbol
R28-R30 = mbed:R
R31-R37 = mbed-rlcq:R
TP1 = mbed-misc:TP
TP2 TP6-TP14 = testpad:TP: Test pad
U$1 = m-pad-2.1:BQ24072
U$2 = m-pad-2.1:SM5100B
U$3 = m-pad-2.1:TPS61030
U$4 = m-pad-2.0:ISM300X_GPS
U$5 U$7-U$11 = m-pad-2.1:SOLAR_CELL
U$6 = m-pad-2.1:ADP3338
U$12 = SparkFun:SIMHOLDER3
U$13 = m-pad-2.1:USD-CARD

## Net classes
0 default: width 0.152 mm, drill 0.305 mm, clearance 0.152 mm
1 supply: width 0.229 mm

## Board
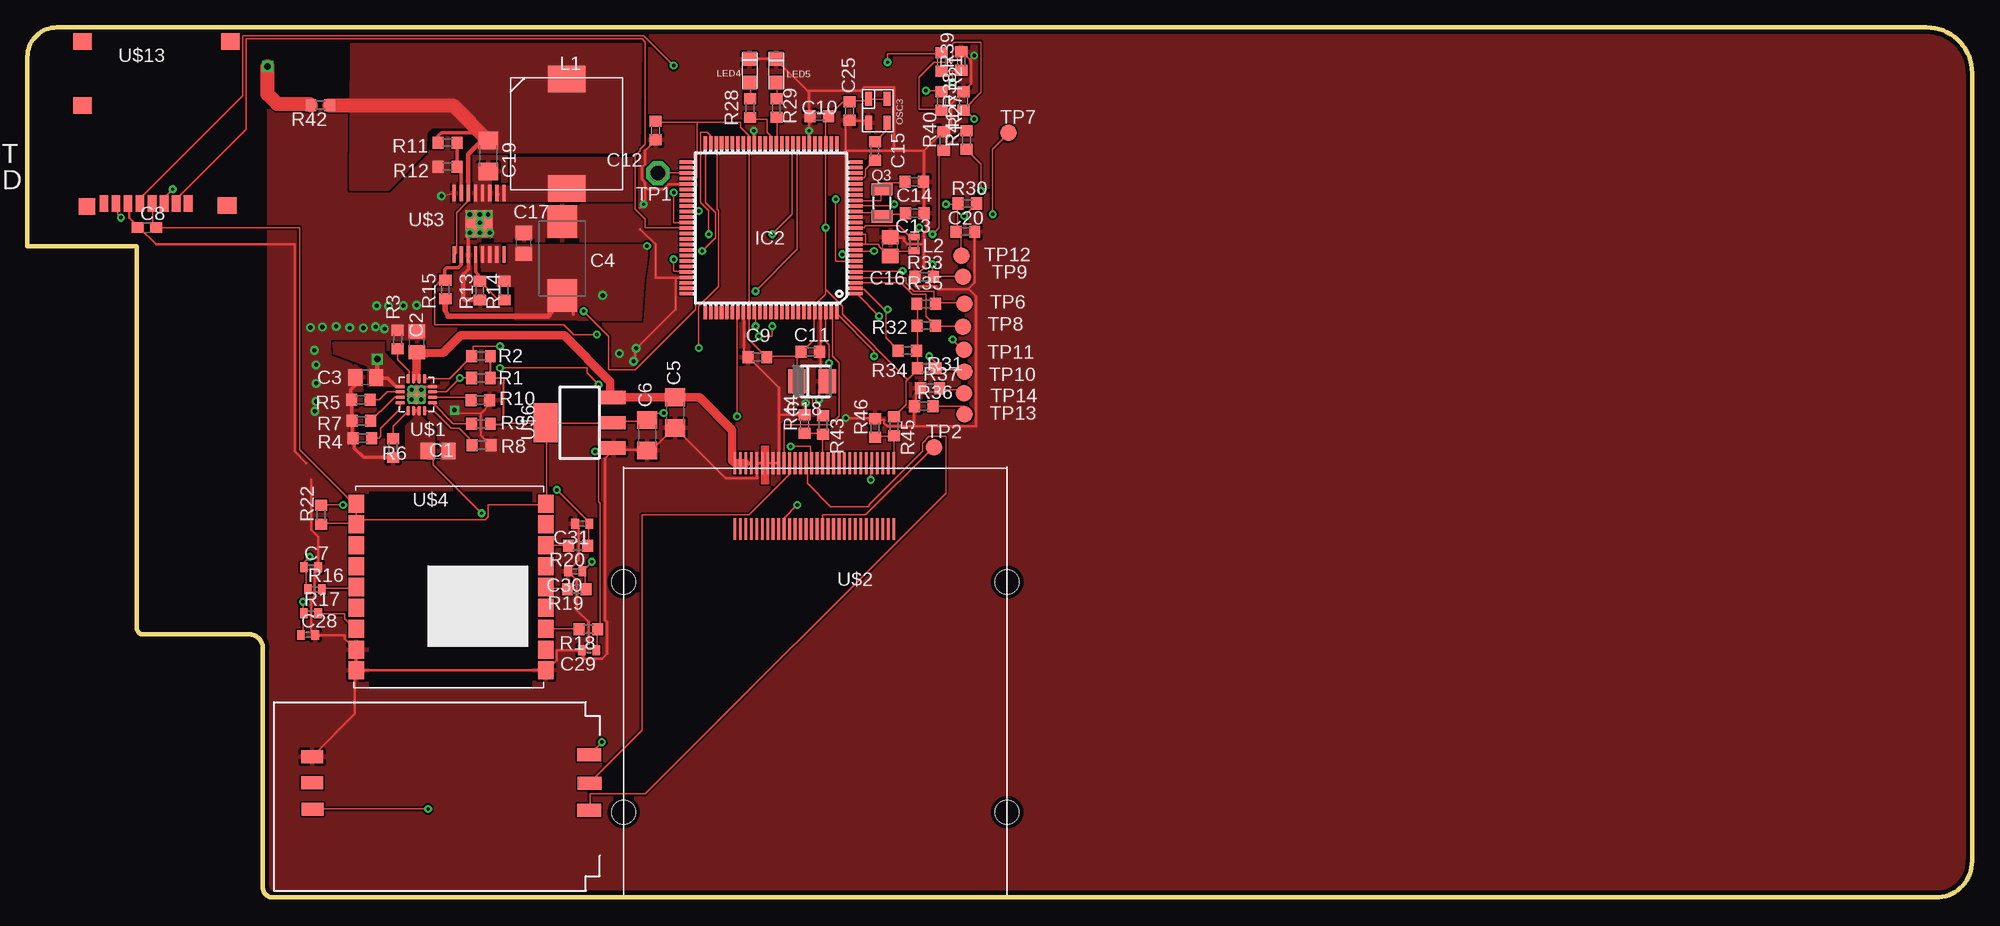
[diagram p7: board, top side]
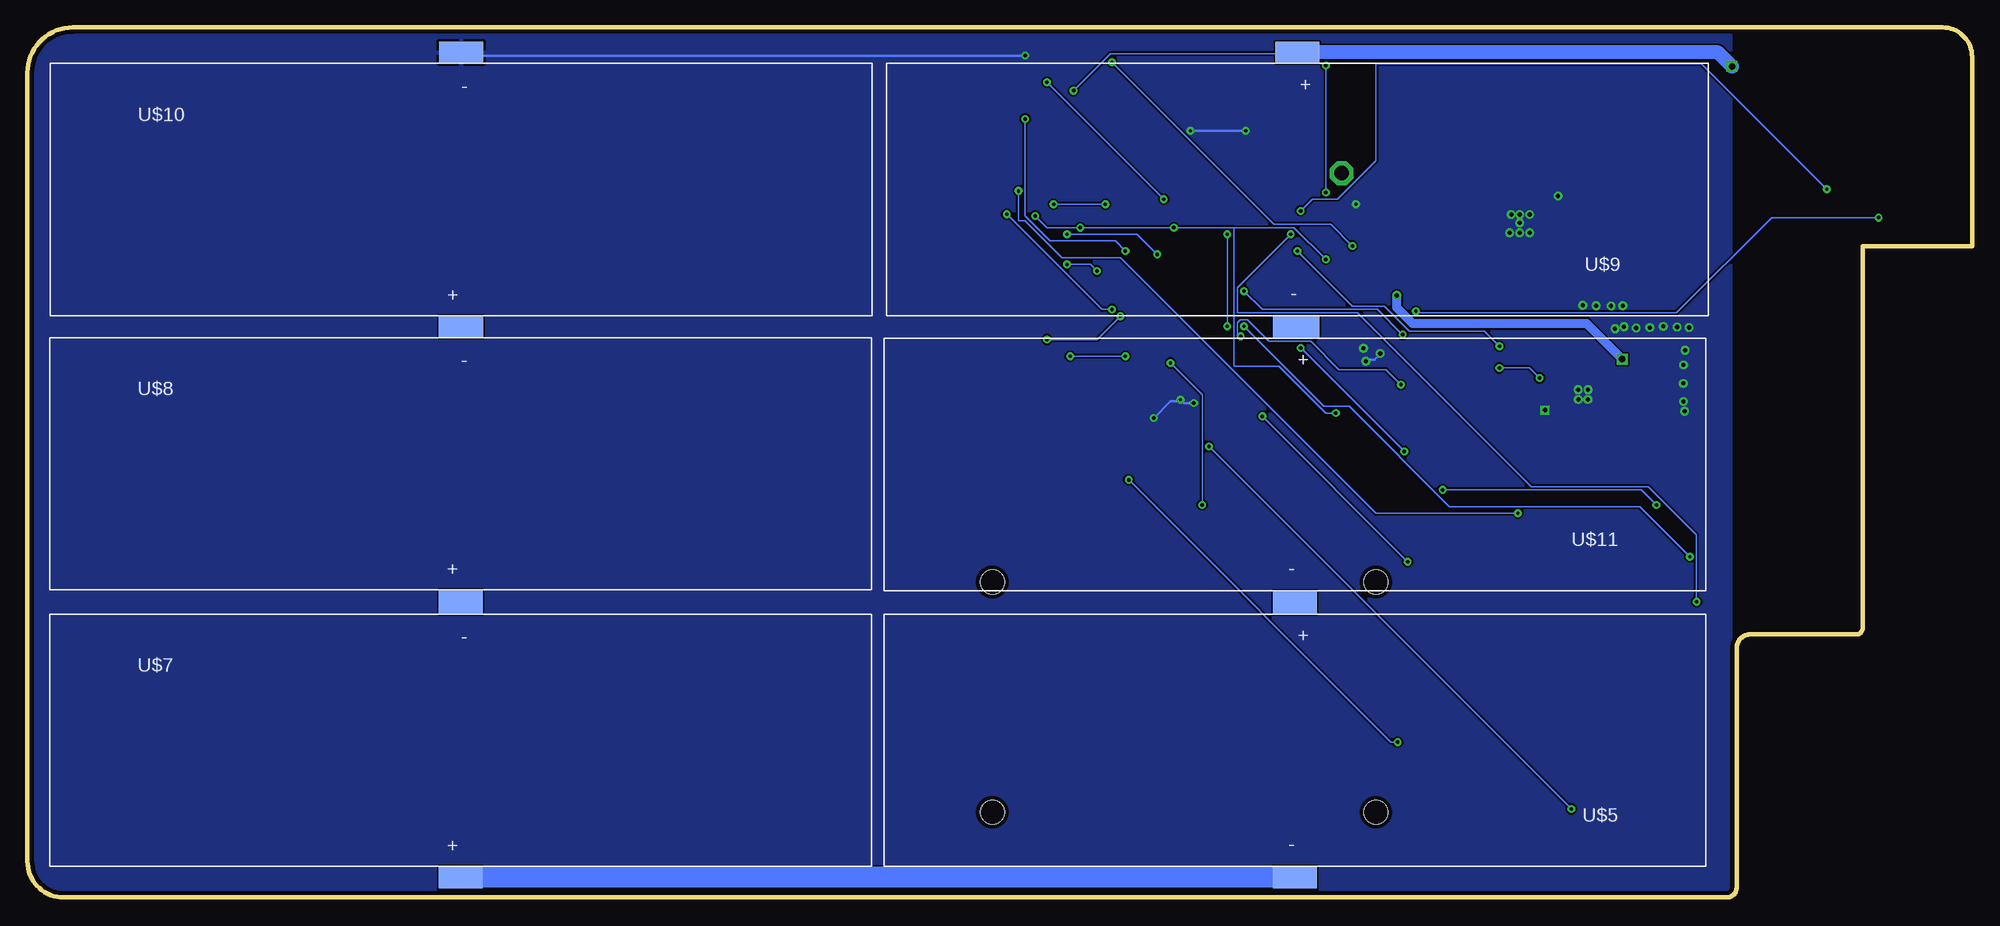
[diagram p8: board, bottom side, seen from below]

Size 177.46 x 79.38 mm. Coordinates in mm from the lower left corner, seen from the top.
Outline: 0,76.69 arc-90 2.69,79.38 173.33,79.38 arc-90 177.46,75.25 177.46,3.32 arc-90 174.14,0 22.39,0 arc-90 21.49,0.92 21.49,22.77 arc90 20.24,24 10.56,24 arc-90 9.99,24.57 9.99,59.41 0,59.41 0,76.69
Copper layers (1*16): Top 0.035mm / dielectric 1.5mm / Bottom 0.035mm
Design rules "default *": minimum track width 6mil, minimum drill 12mil, track to track 6mil, track to pad 15mil, pad to pad 15mil, via to via 6mil, smd to smd 6mil, copper to edge 15mil, drill to drill 8mil, minimum pad ring 10mil, minimum via ring 8mil, stop-mask expansion 4mil, vias tented up to drill 0mil, thermal gap 10mil
tRestrict: area 10.2,24.4 to 20.9,59.4; area 31.2,19 to 46.1,37
bRestrict: area 10.3,24.4 to 20.6,59.5

### Footprints (pad centres in the part's own frame; a part is rotated, then mirrored left to right if it is on the bottom)
C0805 = smd 1.3 x 1.5: 1 -0.95,0; 2 0.95,0
D/7343-31W = smd 2.95 x 2.7: + 3.375,0; - -3.375,0
C1206 = smd 1.6 x 1.8: 1 -1.4,0; 2 1.4,0
C0402 = smd 0.7 x 0.9: 1 -0.65,0; 2 0.65,0
C0603 = smd 1.1 x 1: 1 -0.85,0; 2 0.85,0
0603 = smd 1 x 1.1: 1 -0.85,0; 2 0.85,0
0805 = smd 1.3 x 1.5: 1 -0.85,0; 2 0.85,0
C106B = smd 1.6 x 2.2: 1 -1.4,0; 2 1.4,0
LQFP100 = smd 1.2 x 0.32: 1 -7.75,6; 2 -7.75,5.5; 3 -7.75,5; 4 -7.75,4.5; 5 -7.75,4; 6 -7.75,3.5; 7 -7.75,3; 8 -7.75,2.5; 9 -7.75,2; 10 -7.75,1.5; 11 -7.75,1; 12 -7.75,0.5; 13 -7.75,0; 14 -7.75,-0.5; 15 -7.75,-1; 16 -7.75,-1.5; 17 -7.75,-2; 18 -7.75,-2.5; 19 -7.75,-3; 20 -7.75,-3.5; 21 -7.75,-4; 22 -7.75,-4.5; 23 -7.75,-5; 24 -7.75,-5.5; 25 -7.75,-6; 51 7.75,-6; 52 7.75,-5.5; 53 7.75,-5; 54 7.75,-4.5; 55 7.75,-4; 56 7.75,-3.5; 57 7.75,-3; 58 7.75,-2.5; 59 7.75,-2; 60 7.75,-1.5; 61 7.75,-1; 62 7.75,-0.5; 63 7.75,0; 64 7.75,0.5; 65 7.75,1; 66 7.75,1.5; 67 7.75,2; 68 7.75,2.5; 69 7.75,3; 70 7.75,3.5; 71 7.75,4; 72 7.75,4.5; 73 7.75,5; 74 7.75,5.5; 75 7.75,6 | smd 0.32 x 1.2: 26 -6,-7.75; 27 -5.5,-7.75; 28 -5,-7.75; 29 -4.5,-7.75; 30 -4,-7.75; 31 -3.5,-7.75; 32 -3,-7.75; 33 -2.5,-7.75; 34 -2,-7.75; 35 -1.5,-7.75; 36 -1,-7.75; 37 -0.5,-7.75; 38 0,-7.75; 39 0.5,-7.75; 40 1,-7.75; 41 1.5,-7.75; 42 2,-7.75; 43 2.5,-7.75; 44 3,-7.75; 45 3.5,-7.75; 46 4,-7.75; 47 4.5,-7.75; 48 5,-7.75; 49 5.5,-7.75; 50 6,-7.75; 76 6,7.75; 77 5.5,7.75; 78 5,7.75; 79 4.5,7.75; 80 4,7.75; 81 3.5,7.75; 82 3,7.75; 83 2.5,7.75; 84 2,7.75; 85 1.5,7.75; 86 1,7.75; 87 0.5,7.75; 88 0,7.75; 89 -0.5,7.75; 90 -1,7.75; 91 -1.5,7.75; 92 -2,7.75; 93 -2.5,7.75; 94 -3,7.75; 95 -3.5,7.75; 96 -4,7.75; 97 -4.5,7.75; 98 -5,7.75; 99 -5.5,7.75; 100 -6,7.75
INDUCTOR_7447798620 = smd 3.4 x 2.4: P$1 0,5; P$2 0,-5
L0603 = smd 0.635 x 1.016: P$1 -0.635,0; P$2 0.635,0
LED_0805 = smd 1.2 x 1.25: A 1.05,0; K -1.05,0
OSC3.2X.2.5 = smd 1.27 x 0.635: P$1 -1.092,-0.838; P$2 1.092,-0.838; P$3 1.092,0.838; P$4 -1.092,0.838
FC135 = smd 1.1 x 1.9: X1 -1.25,0; X2 1.25,0
R0603 = smd 1 x 1.1: 1 -0.85,0; 2 0.85,0
R0402 = smd 0.7 x 0.9: 1 -0.65,0; 2 0.65,0
P1-13 = drill 1.321 pad 2.159 octagon: 1 0,0
TP15R = smd 1.5 x 1.5: TP 0,0
S-PVQFN-N16 = smd 0.3 x 0.85: 1 0.75,1.475; 2 0.25,1.475; 3 -0.25,1.475; 4 -0.75,1.475; 9 -0.75,-1.475; 10 -0.25,-1.475; 11 0.25,-1.475; 12 0.75,-1.475 | smd 0.85 x 0.3: 5 -1.475,0.75; 6 -1.475,0.25; 7 -1.475,-0.25; 8 -1.475,-0.75; 13 1.475,-0.75; 14 1.475,-0.25; 15 1.475,0.25; 16 1.475,0.75 | smd 1.7 x 1.7: P$17 0,0
SM5100B = smd 0.25 x 2: 1 7.351,-3; 2 7.351,3; 3 6.851,-3; 4 6.851,3; 5 6.351,-3; 6 6.351,3; 7 5.851,-3; 8 5.851,3; 9 5.351,-3; 10 5.351,3; 11 4.851,-3; 12 4.851,3; 13 4.351,-3; 14 4.351,3; 15 3.851,-3; 16 3.851,3; 17 3.351,-3; 18 3.351,3; 19 2.851,-3; 20 2.851,3; 21 2.351,-3; 22 2.351,3; 23 1.851,-3; 24 1.851,3; 25 1.351,-3; 26 1.351,3; 27 0.851,-3; 28 0.851,3; 29 0.351,-3; 30 0.351,3; 31 -0.149,-3; 32 -0.149,3; 33 -0.649,-3; 34 -0.649,3; 35 -1.149,-3; 36 -1.149,3; 37 -1.649,-3; 38 -1.649,3; 39 -2.149,-3; 40 -2.149,3; 41 -2.649,-3; 42 -2.649,3; 43 -3.149,-3; 44 -3.149,3; 45 -3.649,-3; 46 -3.649,3; 47 -4.149,-3; 48 -4.149,3; 49 -4.649,-3; 50 -4.649,3; 51 -5.149,-3; 52 -5.149,3; 53 -5.649,-3; 54 -5.649,3; 55 -6.149,-3; 56 -6.149,3; 57 -6.649,-3; 58 -6.649,3; 59 -7.149,-3; 60 -7.149,3; P$29 -6.649,3; P$59 -6.649,-3 | hole 2.2: -17.5,7.841; 17.5,7.841; -17.5,28.841; 17.5,28.841
TSSOP16_TI = smd 1.5 x 0.3: 1 -2.8,1.95; 2 -2.8,1.3; 3 -2.8,0.65; 4 -2.8,0; 5 -2.8,-0.65; 6 -2.8,-1.3; 7 -2.8,-1.95; 8 -2.8,-2.6; 9 2.8,-2.6; 10 2.8,-1.95; 11 2.8,-1.3; 12 2.8,-0.65; 13 2.8,0; 14 2.8,0.65; 15 2.8,1.3; 16 2.8,1.95 | smd 2.46 x 2.46: P$1 0,-0.325
INVENTEKSYS_GPS = smd 1.4 x 1.65: 1 -8.644,7.612; 2 -8.644,5.709; 3 -8.645,3.807; 4 -8.645,1.894; 5 -8.643,0; 6 -8.647,-1.907; 7 -8.645,-3.807; 8 -8.645,-5.709; 9 -8.646,-7.599; 10 8.644,-7.612; 11 8.644,-5.709; 12 8.645,-3.807; 13 8.645,-1.894; 14 8.643,0; 15 8.647,1.907; 16 8.645,3.807; 17 8.645,5.709; 18 8.646,7.599
SOLAR_CELL = smd 4 x 2: P$1 0,-1; P$2 0,24
SOT223 = smd 1.219 x 2.235: 1 -2.311,-3.099; 2 0,-3.099; 3 2.311,-3.099 | smd 3.6 x 2.2: 4 0,3.099
SIMHOLDER3 = smd 2.2 x 1.2: 1 0.95,4.81; 2 0.91,7.41; 3 0.95,9.86 | smd 2 x 1.2: 4 26.2,9.78; 5 26.22,7.34; 6 26.22,4.98
502774-0891 = smd 0.8 x 1.5: 1 2.9,-15.61; 2 1.8,-15.61; 3 0.7,-15.61; 4 -0.4,-15.61; 5 -1.5,-15.61; 6 -2.6,-15.61; 7 -3.7,-15.61; 8 -4.8,-15.61 | smd 1.7 x 1.5: P$1 -6.75,-0.85; P$2 6.75,-0.85; P$3 -6.75,-6.7; P$12 6.45,-15.79 | smd 1.5 x 1.5: P$13 -6.346,-15.898

### Placement (x,y rotation side)
C1  37.49,40.74 0 top
C2  35.56,50.69 90 top
C3  30.88,47.44 180 top
C4  48.81,58.3 270 top
C5  59.1,44.24 270 top
C6  56.54,42.18 270 top
C7  25.88,30.13 0 top
C8  10.92,61.12 0 top
C9  66.62,49.31 180 top
C10  72.26,71.26 180 top
C11  71.46,49.78 0 top
C12  57.33,69.98 270 top
C13  80.97,62.41 180 top
C14  80.94,65.29 180 top
C15  77.33,68.1 270 top
C16  78.76,59.39 90 top
C17  45.31,59.68 90 top
C18  71.6,47.08 0 top
C19  42.05,67.65 270 top
C20  85.6,60.76 180 top
C25  75.02,71.76 90 top
C28  25.62,23.95 0 top
C29  51.26,22.57 180 top
C30  50,29.75 180 top
C31  50.63,34.1 180 top
IC2  67.85,61.08 180 top
L1  49.22,69.68 0 top
L2  80.92,59.62 270 top
LED4  65.91,75.43 270 top
LED5  68.31,75.42 270 top
OSC3  77.59,71.78 270 top
Q3  77.98,63.38 270 top
R1  41.4,47.39 0 top
R2  41.4,49.37 0 top
R3  33.78,50.9 90 top
R4  30.58,41.91 180 top
R5  30.43,45.41 180 top
R6  33.37,40.99 90 top
R7  30.48,43.48 180 top
R8  41.45,41.25 0 top
R9  41.4,43.23 0 top
R10  41.35,45.36 0 top
R11  38.35,68.87 180 top
R12  38.35,66.69 0 top
R13  41.29,55.36 90 top
R14  43.53,55.36 90 top
R15  38.14,55.46 270 top
R16  26.24,28.11 0 top
R17  25.89,25.94 0 top
R18  51.2,24.47 180 top
R19  50.12,28.11 180 top
R20  50.25,32.08 180 top
R21  83.42,76.22 270 top
R22  26.81,34.92 90 top
R27  83.41,72.66 270 top
R28  65.95,72.01 90 top
R29  68.35,72.02 90 top
R30  85.77,63.31 0 top
R31  80.3,49.9 0 top
R32  82.04,52.17 180 top
R33  81.86,56.63 180 top
R34  82.08,48.28 180 top
R35  82.01,54.15 180 top
R36  81.81,44.81 0 top
R37  82.37,46.48 0 top
R38  85.42,72.65 90 top
R39  85.22,76.3 90 top
R40  83.62,69.02 90 top
R41  85.69,69.12 90 top
R42  26.72,72.27 180 top
R43  72.62,43.11 270 top
R44  70.93,43.21 90 top
R45  79.07,42.99 270 top
R46  77.34,42.84 90 top
TP1  57.53,66.08 180 top
TP2  82.75,41.07 0 top
TP6  85.51,54.19 0 top
TP7  89.51,69.76 0 top
TP8  85.37,52.09 0 top
TP9  85.39,56.64 0 top
TP10  85.49,47.97 0 top
TP11  85.48,49.97 0 top
TP12  85.24,58.55 0 top
TP13  85.52,44.08 0 top
TP14  85.48,46 0 top
U$1  35.51,45.87 180 top
U$2  71.91,36.62 180 top
U$3  41.55,61.45 270 top
U$4  38.67,28.33 0 top
U$5  61.78,25.84 180 bottom
U$6  50.39,43.31 90 top
U$7  137.92,2.86 0 bottom
U$8  137.92,28.09 0 bottom
U$9  61.58,76.09 180 bottom
U$10  137.9,53.09 0 bottom
U$11  61.78,51 180 bottom
U$12  52.22,17.82 180 top
U$13  11.78,78.93 0 top

### Tracks (layer width: path | path; a pad name or v marks a point on that pad's centre or on a via)
5V_BOOST  (via drill 0.3, 0.41, 0.6)
  Top 0.152: v78.49,76.2 78.49,76.96 83.36,76.96 R21.1
  Top 0.305: 49.79,53.2 49.83,53.78 | U$1.13 33.64,46.62 32.87,47.39 31.88,47.39 C3.1
  Top 0.406: v31.93,49.12 31.93,47.54 C3.1
  Top 0.508: R15.2 38.14,53.58 38.4,53.02 47.51,53.02 C4.+
  Bottom 0.152: v78.49,76.2 63.7,61.42 58.52,61.42 v56.54,59.44
  Bottom 0.813: v52.5,54.93 52.5,53.81 51.04,52.35 35.16,52.35 v31.93,49.12
  pour Top (no thermals): 41.28,59.55 56.36,59.6 56.55,59.45 56.56,59.13 56.6,58.7 56.55,58.29 56.47,57.66 56.26,56.4 56.02,52.6 44.49,52.72 44.49,55.76 42.82,55.76 42.82,57.14 41.45,57.14
  pour Top (no thermals): 34.39,46.63 34.39,47.85 32.56,49.68 32.58,50.64 27.91,50.66 27.97,49.59 27.97,49.63 31.04,48.46 31.04,46.63
12MHZ
  Top 0.152: C15.1 77.42,69.04 78.33,69.95 78.33,70.56 OSC3.P$3
/CE
  Top 0.152: U$1.4 37.08,44.39 38.66,42.82 39.42,42.82 40.33,41.91 40.33,41.51 R8.1
/CHG  (via drill 0.3)
  Top 0.152: U$1.9 38.54,47.34 R2.1 40.69,49.38 40.69,50.29 v43.13,50.29 | v61.57,58.98 62.79,60.2 62.79,62.48 61.87,63.4 61.87,68.73 IC2.50
  Bottom 0.152: v61.57,58.98 56.54,53.95 53.65,53.95 51.36,51.66 44.5,51.66 v43.13,50.29
/PGOOD  (via drill 0.3)
  Top 0.152: v43.13,48.31 51.05,48.31 51.05,47.85 v52.12,46.79 | v66.75,51.21 67.97,51.21 v67.97,52.12 | v67.97,60.5 69.8,62.33 69.8,68.73 IC2.34 | R1.1 40.54,47.4 v39.47,47.4 38.19,46.12 U$1.7
  Bottom 0.152: v39.47,47.4 40.39,48.31 v43.13,48.31 | v52.12,46.79 53.49,48.16 57.76,48.16 60.35,50.75 64.16,50.75 66.14,52.73 66.75,52.73 67.06,52.43 67.06,51.21 v66.75,51.21 | v67.97,52.12 v67.97,60.5
BOOST_INPUT
  Top 0.152: U$3.9 39.01,58.67 39.17,58.83 39.17,62.48 40.23,63.55 40.23,64.16 U$3.6
  Top 0.305: R11.2 37.5,69.5 37.79,69.79 40.87,69.79 41.54,69.12 C19.1 | U$3.6 40.25,65.19 40.23,65.21
  Top 0.406: 40.23,65.21 40.23,67.81 41.54,69.12
  Top 1.27: R42.1 38.84,72.27 C19.1
  pour Top (no thermals): 41.14,67.96 55.92,67.96 56.03,77.9 29.52,77.9 29.42,64.54 32.92,64.54 36.39,68.01 36.42,69.79 36.87,70.24 41.14,70.24
BOOT
  Top 0.152: R44.1 71.02,42.37 72.54,42.37 R43.2 72.54,42.22 72.54,39.62 U$2.33
CHG_IC_EN1
  Top 0.152: U$1.6 40.24,45.62 arc-90 R10.1
CHG_IC_EN2
  Top 0.152: U$1.5 38.87,43.23 R9.1
GND  (via drill 0.3, 0.38, 0.41)
  Top 0.152: U$3.8 38.35,64.1 v37.79,63.99 | U$1.8 36.36,46.62 v35.96,46.32 | U$1.P$17 35.46,45.87 | 41.4,44.19 39.24,44.19 v38.97,44.47
  Top 0.203: R10.2 42.2,44.99 41.4,44.19 41.4,42.15 R8.2
  Top 0.229: LED4.K 65.99,76.5 68.28,76.5 LED5.K 68.43,76.35 71.25,73.53 | IC2.31 71.32,68.89 v71.32,69.95 71.32,71.17 C10.2 71.32,71.32 71.32,73.46 71.25,73.53 | v66.29,69.95 66.29,68.89 IC2.41 | OSC3.P$2 76.66,70.71 76.66,70.87 75.13,70.87 C25.1 74.98,70.87 74.68,70.56 74.68,68.12 | 74.75,61.95 74.83,62.03 75.59,62.03 IC2.15 | 74.75,61.95 74.68,61.87 74.68,60.05 75.59,60.05 IC2.11 | 74.68,68.12 74.68,62.03 74.75,61.95 | 80.92,42.98 78.49,42.98 78.18,43.28 78.18,43.59 77.42,43.59 R46.2 77.27,43.74 v74.68,43.74 | 80.92,42.98 80.92,44.81 R36.1 81.08,44.96 81.08,46.02 81.38,46.33 R37.1 | 86.03,76.43 85.34,77.11 R39.2 | 86.03,76.43 86.11,76.35 86.11,74.22 85.5,73.61 R38.2 85.34,73.46 84.28,72.39 84.28,70.56 83.67,69.95 R40.2 83.52,69.8 81.84,68.12 | 81.84,59.59 81.84,60.66 82.14,60.96 82.14,62.03 81.84,62.33 C13.1 81.84,62.48 81.84,65.23 C14.1 81.84,65.38 81.84,68.12 | 81.84,59.59 81.84,57.45 81.08,56.69 R33.2 81.08,56.54 81.08,55.78 82.91,55.78 83.21,55.47 85.8,55.47 85.88,55.55 | 85.88,55.55 86.41,56.08 86.41,60.66 C20.1 | 81.84,59.59 80.31,59.59 80.01,59.89 80.01,60.2 78.79,60.2 C16.2 | 80.92,42.98 86.56,42.98 86.56,54.86 85.88,55.55 | 86.03,76.43 v86.41,76.81 | 81.84,68.12 79.1,68.12 | 79.1,68.12 74.68,68.12 | 79.1,68.12 79.1,73.91 76.35,73.91 76.05,73.61 71.32,73.61 71.25,73.53 | 53.49,40.84 56.54,40.84 C6.2 56.69,40.84 57,40.84 58.98,42.82 C5.2 59.13,42.82 63.7,38.25 66.6,38.25 66.6,39.47 U$2.9 66.6,39.62 U$2.11 | 53.49,40.84 53.49,41 U$6.1 53.49,40.84 | IC2.97 72.39,53.19 72.39,49.84 C11.2 72.39,49.68 72.39,47.55 72.85,47.09 C18.2 72.85,46.94 72.24,46.33 v72.24,45.41
  Top 0.229: IC2.83 65.38,53.19 65.38,49.68 65.68,49.38 C9.2 65.84,49.23 68.58,46.48 68.58,44.04 | U$2.11 67.51,39.62 U$2.13 67.67,39.62 67.97,39.62 U$2.15 68.12,39.62 68.58,39.62 | U$2.11 | 68.58,44.04 70.87,44.04 R44.2 71.02,44.2 v71.02,45.11 | 68.58,39.62 68.58,44.04 | 68.58,39.62 U$2.17 | C31.2 49.99,33.98 50.29,33.68 50.29,30.79 49.38,29.87 C30.2 49.38,29.72 50.14,28.96 50.14,26.21 51.21,25.15 51.21,23.16 50.75,22.71 C29.2 | C29.2 50.6,22.55 48.31,22.55 48.31,21.64 47.4,20.73 U$4.10 47.24,20.73 U$4.9 | U$4.9 30.02,20.88 30.02,22.55 U$4.8 29.87,22.71 28.96,23.62 28.96,23.93 26.36,23.93 C28.2 26.21,24.08 25.91,24.38 25.91,27.13 26.21,27.43 26.21,29.72 26.52,30.02 C7.2 26.52,30.18 26.52,32.92 25.91,33.53 25.91,38.11 | U$12.6 26.06,12.95 29.87,16.76 29.87,20.73 U$4.9 | v55.32,48.93 55.32,49.07 55.47,49.23 55.47,49.99 v55.55,50.11 55.63,50.14 59.13,53.65 59.13,56.39 59.21,56.46 | 59.21,56.46 59.28,56.54 60.05,56.54 IC2.72 | U$13.6 9.3,63.25 9.3,62.03 10.06,61.27 C8.1 10.21,61.11 11.73,59.59 24.38,59.59 24.38,40.69 25.45,39.62 | v35.06,45.43 35.2,45.57 35.2,45.72 U$1.P$17 | U$1.P$17 35.66,46.02 35.81,46.18 v35.96,46.32 | v35.05,46.33 35.2,46.18 35.36,46.02 U$1.P$17 | U$1.8 37.03,46.63 | R10.2 42.06,45.41 | 56.39,64.62 56.39,63.4 v56.24,63.25 55.93,62.94 | 56.39,64.62 56.39,65.23 56.08,65.53 56.08,66.6 56.39,66.9 56.39,68.12 57.3,69.04 C12.2 | 56.39,64.62 58.06,64.62 58.52,65.08 60.05,65.08 IC2.55 | 59.21,56.46 59.13,56.54 57.3,56.54 57.3,59.59 55.93,60.96 55.93,60.95 | 53.49,40.84 52.73,40.08 52.73,25.3 52.88,25.15 52.88,22.25 52.43,21.79 50.75,21.79 50.75,22.55 C29.2
  Top 0.305: U$3.P$1 41.04,61.3 40.23,60.49 40.23,58.67 U$3.11 40.25,57.31 39.77,56.83 | C3.2 29.93,46.75 29.51,46.33 29.51,45.48 R5.2 29.58,43.53 R7.2 | R7.2 29.63,42.01 R4.2 29.82,41.82 29.82,40.99 30.67,40.14 R6.1 | R7.2 29.22,43.89
  Top 0.406: 39.77,56.83 39.77,54.7 39.92,54.55 41.26,54.55 R13.1
  Top 0.61: U$1.P$17 35.51,45.82 v35.93,45.43
  Bottom 0.152: v38.97,44.47 38.9,44.47 38.75,44.61
  Bottom 0.229: v71.32,69.95 v66.29,69.95 | v86.41,76.81 137.62,76.81 137.77,76.96 U$10.P$2 | v71.02,45.11 71.93,45.11 v72.24,45.41 72.24,45.26 73.15,45.26 v74.68,43.74 | v54.01,49.63 54.1,49.53 54.56,49.07 55.17,49.07 v55.32,48.93
  other vias: 40.38,62.32 41.29,62.32 42.05,62.32 40.38,60.64 41.29,60.64 42.21,60.64 41.29,61.56 31.87,53.98 32.95,53.96 34.32,53.99 35.52,54.03 26.19,49.93 26.34,48.59 26.35,46.9 26.34,45.25 26.24,44.36 28.18,52.11 31.77,52.07 30.66,51.95 29.41,51.99 32.59,51.89 25.82,52 26.92,52.04
  pour Top (no thermals): 29.41,64.15 33.22,64.15 36.57,67.5 38.4,67.5 38.4,63.23 40.84,63.23 40.84,66.89 42.82,66.89 42.82,65.52 42.21,65.52 42.23,63.11 55.95,63.11 55.92,60.18 38.7,60.18 36.26,57.75 36.26,53.33 29.41,53.33
  pour Top (no thermals): 25.45,38.11 25.15,53.09 25.16,53.29 27.03,53.37 32.15,53.36 36.65,53.39 36.67,52.73 36.67,51.05 36.52,50.9 33.02,50.9 33.05,51.21 27.25,51.14 27.31,50.82 27.36,49.25 27.99,49.22 30.51,48.24 30.58,46.17 29.36,46.17 29.34,40.36 29.37,40.19 29.36,39.76 29.38,39.5 29.21,39.35 37.72,39.35 37.67,41.91 43.53,41.91 43.36,38.16
  pour Top (rank 6): 22.01,79.48 178.13,79.48 178.13,-1.79 22.06,-1.79 22.06,78.79
  pour Bottom: 22.07,80.75 178.89,80.75 178.89,-2.85 22.08,-2.85 22.08,80.01
GPS_RESET_L  (via drill 0.3)
  Top 0.152: R20.1 51.21,32.16 51.21,33.98 C31.1 51.21,34.14 51.21,34.29 v48.31,37.19 | v28.8,35.81 26.82,35.81 R22.2
  Bottom 0.152: v28.8,35.81 30.18,37.19 v48.31,37.19
IC6_RTC1
  Top 0.152: 78.03,62.33 80.01,62.33 C13.2 | 78.03,62.33 78.03,62.18 Q3.X2 78.03,62.33 | 78.03,62.33 78.03,62.48 75.74,62.48 IC2.16
IC6_RTC2
  Top 0.152: C14.2 80.01,65.23 78.03,65.23 78.03,64.77 Q3.X1 77.88,64.62 77.88,63.55 75.74,63.55 IC2.18
IC6_XTAL1
  Top 0.152: C15.2 77.27,67.21 76.5,66.45 76.5,65.84 76.35,65.68 75.74,65.68 IC2.22
LED-3
  Top 0.152: R28.1 65.99,71.02 67.51,71.02 67.51,69.8 67.82,69.49 67.82,68.89 IC2.38
LED-4
  Top 0.152: R29.1 68.43,71.17 68.43,68.89 IC2.37
LOW_BAT_DETECT  (via drill 0.3)
  Top 0.152: R15.1 37.72,56.31 37.19,55.77 | 37.19,55.77 37.18,55.77 | v66.45,55.32 70.26,59.13 70.26,68.73 IC2.33 | v51.97,51.36 49.84,51.36 48.92,52.27 37.19,52.27 37.19,55.78 37.19,55.77
  Top 0.305: U$3.10 39.6,57.73 39.31,57.44 38.24,57.44 38.09,57.29 38.09,56.36 R15.1
  Bottom 0.152: v66.45,55.32 64.77,53.65 54.25,53.65 v51.97,51.36
MISO  (via drill 0.3)
  Top 0.152: v50.75,53.49 53.03,51.21 53.03,48.16 55.47,48.16 60.96,53.65 60.96,62.03 60.2,62.03 IC2.61 | v8.53,62.03 8.23,62.33 8.23,63.25 U$13.7
  Bottom 0.152: v50.75,53.49 50.6,53.34 26.98,53.34 18.29,62.03 v8.53,62.03
MOSI  (via drill 0.3)
  Top 0.152: v61.27,62.64 60.2,62.64 IC2.60 | v13.26,64.62 12.5,63.86 12.5,63.4 U$13.3
  Bottom 0.152: v61.27,62.64 60.2,63.7 57.91,63.7 54.41,67.21 54.41,76.05 24.69,76.05 v13.26,64.62
N$1
  Top 0.152: U$1.14 32.81,46.12 32.1,45.41 R5.1
N$2
  Top 0.152: R3.1 33.78,49.07 34.85,48 34.85,47.43 U$1.12
N$3
  Top 0.152: U$1.16 34.03,44.6 32.26,42.82 32.26,42.06 32.1,41.91 R4.1
N$5
  Top 0.152: R16.2 26.98,28.19 29.87,28.19 U$4.5
N$6
  Top 0.152: R17.2 26.67,25.91 28.96,25.91 28.96,25.45 29.87,24.54 U$4.7
N$7
  Top 0.152: L2.P$2 80.77,58.98 78.79,58.98 78.79,58.67 C16.1 78.64,58.52 77.72,59.44 77.72,59.59 76.5,59.59 | 76.5,59.59 75.74,59.59 IC2.10 | 76.5,59.59 76.5,60.5 75.74,60.5 IC2.12
N$8
  Top 0.152: R18.2 50.29,24.54 47.4,24.54 U$4.12
N$9
  Top 0.152: R19.2 49.23,28.19 47.4,28.19 U$4.14
N$10
  Top 0.152: R20.2 49.38,32.16 47.4,32.16 U$4.16
N$11
  Bottom 0.152: U$10.P$1 137.92,52.12 U$8.P$2
N$12
  Bottom 0.152: U$7.P$2 137.92,26.98 U$8.P$1
N$14
  Top 0.305: U$3.2 42.86,64.25 42.97,64.15
  pour Top (no thermals): 42.82,63.54 55.92,63.54 55.92,67.5 44.04,67.5 44.04,64.91 42.82,64.91
N$17
  Top 0.152: R29.2 68.43,73 68.43,74.22 LED5.A
N$18
  Top 0.152: R28.2 65.99,73 65.99,74.37 LED4.A
N$20
  Top 0.305: U$3.7 39.6,66.29 R12.2 R11.1
N$24
  Top 0.152: R13.2 41.31,56.21 42.97,54.55 43.49,54.55 R14.1
  Top 0.305: U$3.12 40.9,57.08 41.14,56.83 41.14,56.36 R13.2
N$33
  Bottom 1.93: U$5.P$2 137.92,1.84 U$7.P$1
N$34
  Bottom 0.152: U$11.P$2 61.87,26.98 U$5.P$1
N$35
  Bottom 0.152: U$9.P$2 61.72,52.12 U$11.P$1
N$43
  Top 0.152: TP2.TP 82.6,41 76.5,34.9 72.54,34.9 72.54,33.68 U$2.34
PM_SYS_POWER
  Top 0.254: U$2.5 U$2.7 | 36.44,49.67 35.62,49.68 C2.1
  Top 0.305: U$1.11 U$1.10 35.47,47.54
  Top 0.762: 35.47,47.54 C2.1 | 36.44,49.67 37.93,49.68 39.55,51.3 48.96,51.3 53.19,47.07 53.19,45.91 U$6.3 59.08,45.62 C5.1 61.32,45.64 64.33,42.63 64.33,39.85 U$2.1 U$2.3 U$2.5
PON
  Top 0.152: R46.1 77.42,42.06 78.94,42.06 R45.2 79.1,42.06 79.1,39.62 U$2.59
RXD0  (via drill 0.3)
  Top 0.152: v73.15,48.77 73.15,50.44 72.85,50.75 72.85,53.19 IC2.98 | v70.26,35.81 69.04,34.59 69.04,33.68 U$2.20
  Bottom 0.152: v73.15,48.77 70.26,45.87 v70.26,35.81
RXD2  (via drill 0.3)
  Top 0.152: C28.1 24.99,24.08 25.15,24.23 25.15,25.91 R17.1 25.15,26.06 v25.15,26.98 | v62.18,60.5 62.18,62.64 61.42,63.4 61.42,69.8 62.03,69.8 62.33,69.49 62.33,68.89 IC2.49
  Bottom 0.152: v62.18,60.5 67.06,55.63 67.06,53.34 56.08,53.34 40.23,37.49 29.57,37.49 25.15,33.07 v25.15,26.98
RXD3  (via drill 0.3)
  Top 0.152: R16.1 25.45,28.19 25.45,29.87 25.3,30.02 C7.1 25.3,30.18 25.3,30.63 v25.76,31.09 | v66.45,52.12 66.45,53.19 IC2.85
  Bottom 0.152: v66.45,52.12 59.13,44.81 56.84,44.81 47.7,35.66 30.33,35.66 v25.76,31.09
SCK  (via drill 0.3)
  Top 0.152: v58.98,64.31 58.98,61.57 60.05,61.57 IC2.62 | v58.98,75.89 56.24,78.64 19.66,78.64 19.66,73.15 10.36,63.86 10.36,63.4 U$13.5
  Bottom 0.152: v58.98,75.89 v58.98,64.31
SIM_CLK
  Top 0.152: U$2.27 71.17,39.47 71.17,37.8 73.3,35.66 76.81,35.66 76.81,35.81 81.69,40.69 81.69,41.45 82.3,42.06 83.82,42.06 83.82,36.88 56.39,9.45 51.36,9.45 51.36,8.08 U$12.3
SIM_IO  (via drill 0.3)
  Top 0.152: v36.58,8.08 26.06,8.08 U$12.4 | v69.65,41.15 71.48,41.15 71.48,39.62 U$2.29
  Bottom 0.152: v36.58,8.08 v69.65,41.15
SIM_RST
  Top 0.152: U$2.21 69.49,39.47 69.49,38.56 65.84,34.9 56.08,34.9 56.08,15.24 51.36,10.52 U$12.2
SIM_VCC  (via drill 0.3)
  Top 0.152: v76.96,38.1 76.96,39.47 U$2.51 | v52.43,14.17 51.36,13.11 U$12.1
  Bottom 0.152: v76.96,38.1 53.03,14.17 v52.43,14.17
SOLAR_PLUS  (via drill 0.3, 0.6)
  Top 0.152: v81.99,73.61 83.36,73.61 R27.1
  Top 1.27: v21.92,75.81 21.92,73.28 22.79,72.41 25.73,72.41 R42.2
  Bottom 0.152: v81.99,73.61 78.64,76.96 62.18,76.96 U$9.P$1
  Bottom 1.27: U$9.P$1 23.2,77.09 v21.92,75.81
SS
  Top 0.152: IC2.63 60.05,61.11 56.39,61.11 56.39,61.87 55.47,62.79 55.47,67.67 55.93,68.12 55.93,68.28 56.39,68.73 56.39,78.03 56.08,78.33 19.96,78.33 19.96,70.1 13.72,63.86 13.72,63.4 U$13.2
TD
  Top 0.152: U$1.15 33.53,45.62 32.26,44.34 32.19,44.34 R7.1
TGT_NRESET  (via drill 0.3)
  Top 0.152: TP12.TP 85.19,58.67 85.19,60.35 84.89,60.66 C20.2 84.89,60.81 84.89,63.25 | v79.1,63.25 79.1,63.09 75.74,63.09 IC2.17 | v83.82,63.25 84.89,63.25 | 84.89,63.25 R30.1
  Bottom 0.152: v79.1,63.25 v83.82,63.25
TGT_RTCK  (via drill 0.3)
  Top 0.152: TP10.TP 85.34,48.01 85.34,48.16 83.06,48.16 R34.1 82.91,48.31 82.91,48.77 v82.3,49.38 | v77.27,49.38 77.27,49.84 73.91,53.19 IC2.100
  Bottom 0.152: v77.27,49.38 v82.3,49.38
TGT_SBL_ISP
  Top 0.152: IC2.53 60.05,66.14 57.61,66.14 TP1.1
TGT_SBL_RXD
  Top 0.152: R37.2 83.36,46.33 85.34,46.33 85.34,46.02 TP14.TP
TGT_SBL_TXD
  Top 0.152: R36.2 82.75,44.81 85.5,44.81 85.5,44.2 TP13.TP
TGT_TCK  (via drill 0.3)
  Top 0.152: TP9.TP 85.34,56.69 82.75,56.69 R33.1 82.6,56.69 v82.6,57.76 | v79.86,57.15 75.74,57.15 IC2.5
  Bottom 0.152: v79.86,57.15 80.47,57.76 v82.6,57.76
TGT_TDI  (via drill 0.3)
  Top 0.152: 78.33,53.49 78.33,51.05 79.4,49.99 R31.1 | 78.33,53.49 76.35,55.47 75.74,55.47 IC2.2 | v88.09,62.33 88.09,68.28 89.46,69.65 TP7.TP | 78.33,53.49 v78.49,53.65
  Bottom 0.152: v88.09,62.33 79.4,53.65 v78.49,53.65
TGT_TDO  (via drill 0.3)
  Top 0.152: v77.72,53.03 75.74,55.02 IC2.1 | v84.43,50.9 85.34,49.99 TP11.TP
  Bottom 0.152: v77.72,53.03 79.86,50.9 v84.43,50.9
TGT_TMS
  Top 0.152: TP8.TP 85.34,52.12 82.91,52.12 R32.1 82.75,52.27 81.99,53.03 81.99,55.02 80.77,55.02 79.86,55.93 79.86,56.08 75.74,56.08 IC2.3
TGT_TRST
  Top 0.152: TP6.TP 85.5,54.25 82.91,54.25 R35.1 82.75,54.25 82.75,55.32 80.92,55.32 80.16,56.08 80.16,56.54 75.74,56.54 IC2.4
TS
  Top 0.152: U$1.1 34.75,44.35 33.38,42.98 33.38,41.91 R6.2
TXD0
  Top 0.152: IC2.99 73.46,53.19 73.46,49.38 74.07,48.77 74.07,43.89 73.3,43.13 69.04,43.13 69.04,39.62 U$2.19
TXD2  (via drill 0.3)
  Top 0.152: C29.1 51.97,22.71 51.97,24.38 R18.1 52.12,24.54 52.27,24.69 52.27,35.97 52.12,36.12 52.12,40.39 v51.82,40.69 | v61.27,50.14 61.27,53.95 63.09,55.78 63.09,62.64 62.94,62.79 62.94,68.73 IC2.48
  Bottom 0.152: v51.82,40.69 v61.27,50.14
TXD3  (via drill 0.3)
  Top 0.152: R19.1 50.9,28.19 50.9,29.57 50.75,29.72 C30.1 50.75,29.87 v51.51,30.63 | v64.77,43.89 64.77,53.19 IC2.82
  Bottom 0.152: v51.51,30.63 v64.77,43.89
VAD_BATTERY  (via drill 0.3)
  Top 0.152: R41.2 85.65,69.95 85.34,69.95 83.67,68.28 R40.1 83.52,68.12 83.21,67.82 83.21,61.11 v82.6,60.5 | v74.37,58.67 75.59,58.67 IC2.8
  Bottom 0.152: v74.37,58.67 76.2,60.5 v82.6,60.5
VAD_BOOST  (via drill 0.3)
  Top 0.152: 84.43,75.44 85.19,75.44 R39.1 | 84.43,75.44 83.52,75.44 R21.2 | v73.76,63.7 73.76,58.06 75.59,58.06 IC2.7 | v84.43,74.37 84.43,75.44
  Bottom 0.152: v73.76,63.7 v84.43,74.37
VAD_SOLAR  (via drill 0.3)
  Top 0.152: 85.5,71.93 87.02,73.46 87.02,78.03 84.58,78.03 84.43,77.88 84.43,76.2 82.75,76.2 81.38,74.83 81.38,71.93 83.36,71.93 R27.2 | v77.27,58.98 75.74,58.98 IC2.9 | v86.41,71.02 85.5,71.93 | 85.5,71.93 R38.1
  Bottom 0.152: v77.27,58.98 78.18,59.89 84.12,59.89 86.41,62.18 v86.41,71.02
VBAT  (via drill 0.3)
  Top 0.152: v87.02,64.47 87.02,66.9 85.8,68.12 R41.1 | v41.45,35.05 37.03,39.47 37.03,39.93 37.03,39.99
  Top 0.305: U$1.2 U$1.3
  Bottom 0.152: v87.02,64.47 87.02,61.72 86.41,61.72 83.06,58.37 77.72,58.37 54.41,35.05 v41.45,35.05
  pour Top (no thermals): 35.3,44.65 35.76,44.65 35.77,44 37.15,42.62 37.1,39.99 36.45,40 35.11,40.02 34.44,40.04 34.49,40.09 34.53,40.32 34.56,40.39 34.53,40.57 34.5,40.85 34.5,41.04 34.53,41.27 34.52,41.45 34.51,43 35.27,43.76
VCC_3.3V  (via drill 0.3)
  Top 0.152: 43.46,46.94 43.52,47.35 | 43.44,43.34 43.45,43.51 | IC2.13 75.74,61.11 76.35,61.11 76.5,61.27 79.55,61.27 80.47,60.35 80.77,60.35 L2.P$1 80.92,60.35 80.92,60.66 v81.38,61.11 | v85.5,62.18 86.56,63.25 R30.2 | v58.98,58.22 58.98,57.15 60.05,57.15 IC2.71 | 61.11,70.71 65.08,70.71 65.08,70.26 65.84,69.49 65.84,68.89 IC2.42 65.84,68.73 65.84,53.34 IC2.84 65.84,53.19 65.84,50.9 67.36,49.38 C9.1 67.51,49.38 70.26,49.38 | 61.11,70.71 57.45,70.71 C12.1 | 61.11,70.71 61.11,65.68 60.2,65.68 IC2.54 | R35.2 81.23,54.1 81.23,52.27 R32.2 81.23,52.12 81.23,49.99 R31.2 81.23,49.84 81.23,48.31 R34.2 81.23,48.16 80.31,47.24 | 80.31,47.24 80.16,47.09 80.16,44.96 79.1,43.89 R45.1 | OSC3.P$4 78.33,72.85 76.81,72.85 OSC3.P$1 76.66,72.85 76.66,72.69 75.13,72.69 C25.2 74.98,72.54 74.37,72.54 73.15,71.32 C10.1 73,71.17 72.85,71.02 72.85,68.89 IC2.28 72.85,68.73 v72.85,61.11 72.85,55.47 | R43.1 72.54,44.04 71.63,44.96 71.63,45.57 70.26,46.94 C18.1 70.26,47.09 70.26,49.38 | 70.26,49.38 70.56,49.38 70.56,49.68 C11.1 | C11.1 70.71,49.84 71.78,50.9 71.78,53.19 IC2.96 71.93,53.34 71.93,54.1 72.85,55.02 72.85,55.47 | C11.1 70.26,49.38 | 80.31,47.24 74.37,53.19 74.37,53.95 72.85,55.47 | 47.4,43.28 47.4,35.97 U$4.18 47.24,35.81 42.06,35.81 42.06,34.75 41.76,34.44 30.02,34.44 | 47.4,43.28 53.34,43.28 U$6.2 53.49,43.43 56.54,43.43 C6.1 56.69,43.59 56.69,44.2 v58.06,44.2 | 47.4,43.28 U$6.4 47.24,43.28 43.43,43.28 43.41,43.31 | U$13.4 11.43,63.25 11.43,61.57 11.73,61.27 C8.2 11.89,61.11 24.84,61.11 24.84,40.84 29.87,35.81 U$4.1 30.02,35.81 30.02,34.44 | R22.1 26.82,34.14 29.87,34.14 U$4.2
  Top 0.152: 30.02,34.44 30.02,34.14 U$4.2 | U$4.2 30.02,34.44
  Top 0.203: R2.2 R1.2 43.53,47.39 43.46,46.94 43.46,43.89 43.44,43.34 43.41,43.31 43.23,43.12 42.35,43.12 R9.2
  Bottom 0.152: v85.5,62.18 84.43,61.11 v81.38,61.11 v72.85,61.11 67.36,61.11 | v58.98,58.22 61.87,61.11 67.36,61.11 | 67.36,61.11 67.36,48.46 63.25,48.46 58.98,44.2 v58.06,44.2
(copper drawn outside any net)
  shapes: Top area x1

### Text on the board
tNames: OUT | GND | IN